# EAGLE design box_opener (EAGLE 9.3.2)
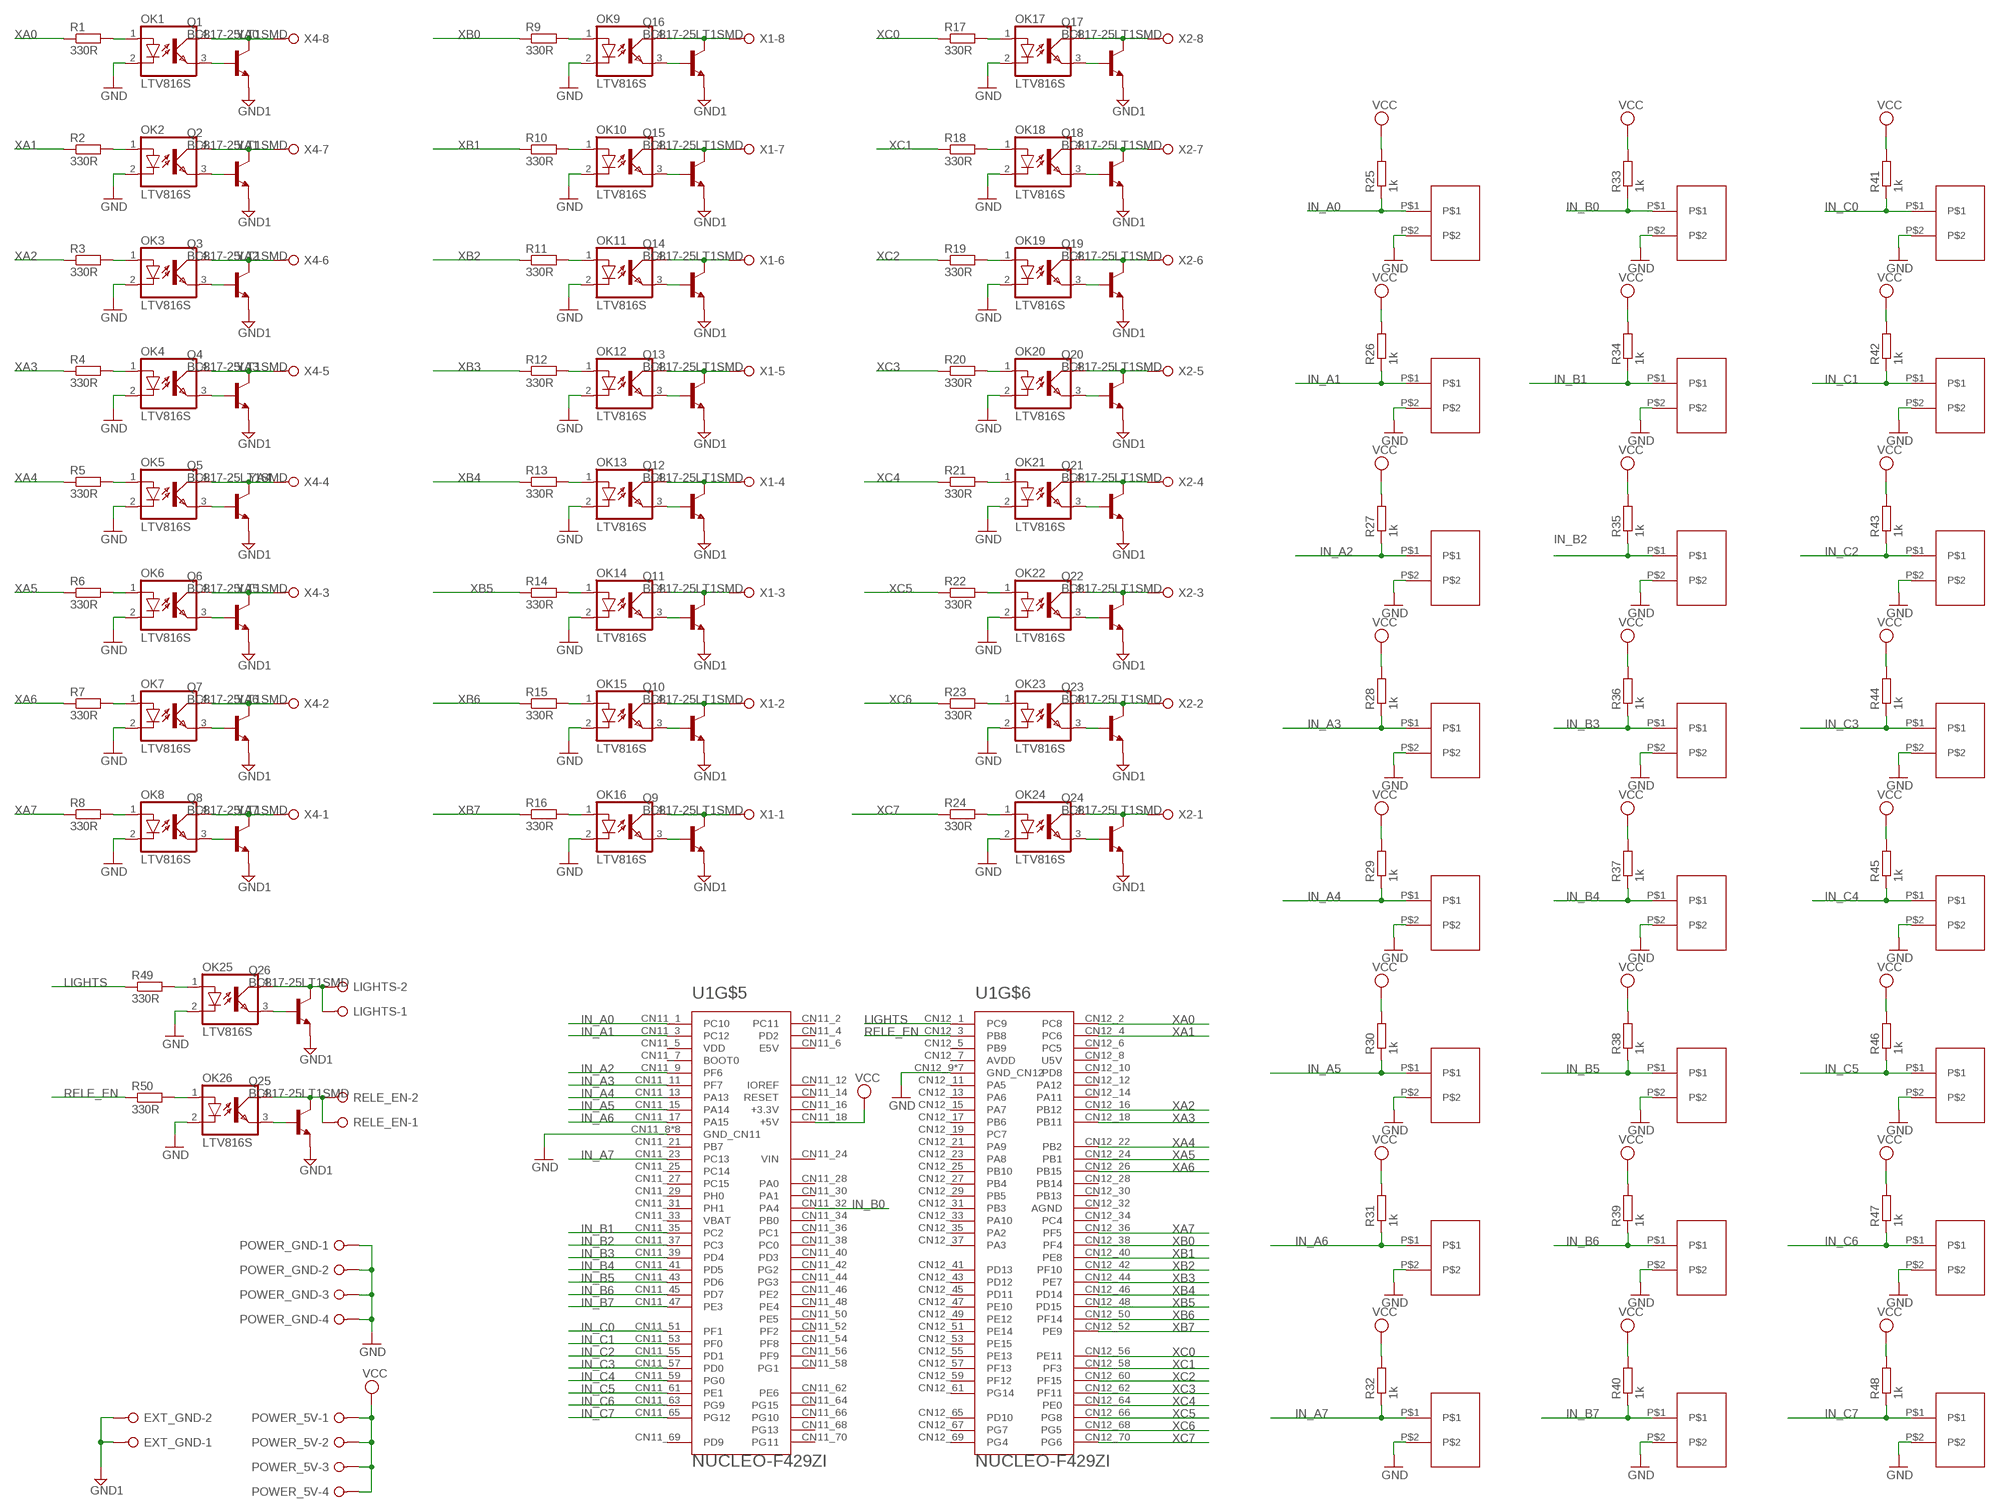
[diagram p0: schematic, sheet 1]

## Parts
EXT_GND  W237-02P  [W237-132]
LIGHTS  W237-02P  [W237-132]
OK1  LTV816S  [DIL4-SMD]
OK2  LTV816S  [DIL4-SMD]
OK3  LTV816S  [DIL4-SMD]
OK4  LTV816S  [DIL4-SMD]
OK5  LTV816S  [DIL4-SMD]
OK6  LTV816S  [DIL4-SMD]
OK7  LTV816S  [DIL4-SMD]
OK8  LTV816S  [DIL4-SMD]
OK9  LTV816S  [DIL4-SMD]
OK10  LTV816S  [DIL4-SMD]
OK11  LTV816S  [DIL4-SMD]
OK12  LTV816S  [DIL4-SMD]
OK13  LTV816S  [DIL4-SMD]
OK14  LTV816S  [DIL4-SMD]
OK15  LTV816S  [DIL4-SMD]
OK16  LTV816S  [DIL4-SMD]
OK17  LTV816S  [DIL4-SMD]
OK18  LTV816S  [DIL4-SMD]
OK19  LTV816S  [DIL4-SMD]
OK20  LTV816S  [DIL4-SMD]
OK21  LTV816S  [DIL4-SMD]
OK22  LTV816S  [DIL4-SMD]
OK23  LTV816S  [DIL4-SMD]
OK24  LTV816S  [DIL4-SMD]
OK25  LTV816S  [DIL4-SMD]
OK26  LTV816S  [DIL4-SMD]
POWER_5V  W237-04P  [W237-4P]
POWER_GND  W237-04P  [W237-4P]
Q1  BC817-25LT1SMD  [SOT23-BEC]
Q2  BC817-25LT1SMD  [SOT23-BEC]
Q3  BC817-25LT1SMD  [SOT23-BEC]
Q4  BC817-25LT1SMD  [SOT23-BEC]
Q5  BC817-25LT1SMD  [SOT23-BEC]
Q6  BC817-25LT1SMD  [SOT23-BEC]
Q7  BC817-25LT1SMD  [SOT23-BEC]
Q8  BC817-25LT1SMD  [SOT23-BEC]
Q9  BC817-25LT1SMD  [SOT23-BEC]
Q10  BC817-25LT1SMD  [SOT23-BEC]
Q11  BC817-25LT1SMD  [SOT23-BEC]
Q12  BC817-25LT1SMD  [SOT23-BEC]
Q13  BC817-25LT1SMD  [SOT23-BEC]
Q14  BC817-25LT1SMD  [SOT23-BEC]
Q15  BC817-25LT1SMD  [SOT23-BEC]
Q16  BC817-25LT1SMD  [SOT23-BEC]
Q17  BC817-25LT1SMD  [SOT23-BEC]
Q18  BC817-25LT1SMD  [SOT23-BEC]
Q19  BC817-25LT1SMD  [SOT23-BEC]
Q20  BC817-25LT1SMD  [SOT23-BEC]
Q21  BC817-25LT1SMD  [SOT23-BEC]
Q22  BC817-25LT1SMD  [SOT23-BEC]
Q23  BC817-25LT1SMD  [SOT23-BEC]
Q24  BC817-25LT1SMD  [SOT23-BEC]
Q25  BC817-25LT1SMD  [SOT23-BEC]
Q26  BC817-25LT1SMD  [SOT23-BEC]
R1  330R  R-EU_M1206  [M1206]
R2  330R  R-EU_M1206  [M1206]
R3  330R  R-EU_M1206  [M1206]
R4  330R  R-EU_M1206  [M1206]
R5  330R  R-EU_M1206  [M1206]
R6  330R  R-EU_M1206  [M1206]
R7  330R  R-EU_M1206  [M1206]
R8  330R  R-EU_M1206  [M1206]
R9  330R  R-EU_M1206  [M1206]
R10  330R  R-EU_M1206  [M1206]
R11  330R  R-EU_M1206  [M1206]
R12  330R  R-EU_M1206  [M1206]
R13  330R  R-EU_M1206  [M1206]
R14  330R  R-EU_M1206  [M1206]
R15  330R  R-EU_M1206  [M1206]
R16  330R  R-EU_M1206  [M1206]
R17  330R  R-EU_M1206  [M1206]
R18  330R  R-EU_M1206  [M1206]
R19  330R  R-EU_M1206  [M1206]
R20  330R  R-EU_M1206  [M1206]
R21  330R  R-EU_M1206  [M1206]
R22  330R  R-EU_M1206  [M1206]
R23  330R  R-EU_M1206  [M1206]
R24  330R  R-EU_M1206  [M1206]
R25  1k  R-EU_M1206  [M1206]
R26  1k  R-EU_M1206  [M1206]
R27  1k  R-EU_M1206  [M1206]
R28  1k  R-EU_M1206  [M1206]
R29  1k  R-EU_M1206  [M1206]
R30  1k  R-EU_M1206  [M1206]
R31  1k  R-EU_M1206  [M1206]
R32  1k  R-EU_M1206  [M1206]
R33  1k  R-EU_M1206  [M1206]
R34  1k  R-EU_M1206  [M1206]
R35  1k  R-EU_M1206  [M1206]
R36  1k  R-EU_M1206  [M1206]
R37  1k  R-EU_M1206  [M1206]
R38  1k  R-EU_M1206  [M1206]
R39  1k  R-EU_M1206  [M1206]
R40  1k  R-EU_M1206  [M1206]
R41  1k  R-EU_M1206  [M1206]
R42  1k  R-EU_M1206  [M1206]
R43  1k  R-EU_M1206  [M1206]
R44  1k  R-EU_M1206  [M1206]
R45  1k  R-EU_M1206  [M1206]
R46  1k  R-EU_M1206  [M1206]
R47  1k  R-EU_M1206  [M1206]
R48  1k  R-EU_M1206  [M1206]
R49  330R  R-EU_M1206  [M1206]
R50  330R  R-EU_M1206  [M1206]
RELE_EN  W237-02P  [W237-132]
U1  NUCLEO-F429ZI  [MODULE_NUCLEO-F429ZI]
U$1  PSH04-02  [PSH04-02]
U$2  PSH04-02  [PSH04-02]
U$3  PSH04-02  [PSH04-02]
U$4  PSH04-02  [PSH04-02]
U$5  PSH04-02  [PSH04-02]
U$6  PSH04-02  [PSH04-02]
U$7  PSH04-02  [PSH04-02]
U$8  PSH04-02  [PSH04-02]
U$9  PSH04-02  [PSH04-02]
U$10  PSH04-02  [PSH04-02]
U$11  PSH04-02  [PSH04-02]
U$12  PSH04-02  [PSH04-02]
U$13  PSH04-02  [PSH04-02]
U$14  PSH04-02  [PSH04-02]
U$15  PSH04-02  [PSH04-02]
U$16  PSH04-02  [PSH04-02]
U$17  PSH04-02  [PSH04-02]
U$18  PSH04-02  [PSH04-02]
U$19  PSH04-02  [PSH04-02]
U$20  PSH04-02  [PSH04-02]
U$21  PSH04-02  [PSH04-02]
U$22  PSH04-02  [PSH04-02]
U$23  PSH04-02  [PSH04-02]
U$24  PSH04-02  [PSH04-02]
X1  W237-08P  [W237-8P]
X2  W237-08P  [W237-8P]
X4  W237-08P  [W237-8P]

## Nets
GND: OK1.2(C) OK2.2(C) OK3.2(C) OK4.2(C) OK5.2(C) OK6.2(C) OK7.2(C) OK8.2(C) OK9.2(C) OK10.2(C) OK11.2(C) OK12.2(C) OK13.2(C) OK14.2(C) OK15.2(C) OK16.2(C) OK17.2(C) OK18.2(C) OK19.2(C) OK20.2(C) OK21.2(C) OK22.2(C) OK23.2(C) OK24.2(C) OK25.2(C) OK26.2(C) POWER_GND.1 POWER_GND.2 POWER_GND.3 POWER_GND.4 U1.CN11_8(GND_CN11) U1.CN11_19(GND_CN11) U1.CN11_20(GND_CN11) U1.CN11_22(GND_CN11) U1.CN11_49(GND_CN11) U1.CN11_60(GND_CN11) U1.CN11_71(GND_CN11) U1.CN11_72(GND_CN11) U1.CN12_9(GND_CN12) U1.CN12_20(GND_CN12) U1.CN12_39(GND_CN12) U1.CN12_54(GND_CN12) U1.CN12_63(GND_CN12) U1.CN12_71(GND_CN12) U1.CN12_72(GND_CN12) U$1.P$2 U$2.P$2 U$3.P$2 U$4.P$2 U$5.P$2 U$6.P$2 U$7.P$2 U$8.P$2 U$9.P$2 U$10.P$2 U$11.P$2 U$12.P$2 U$13.P$2 U$14.P$2 U$15.P$2 U$16.P$2 U$17.P$2 U$18.P$2 U$19.P$2 U$20.P$2 U$21.P$2 U$22.P$2 U$23.P$2 U$24.P$2
GND1: EXT_GND.1 EXT_GND.2 Q1.E Q2.E Q3.E Q4.E Q5.E Q6.E Q7.E Q8.E Q9.E Q10.E Q11.E Q12.E Q13.E Q14.E Q15.E Q16.E Q17.E Q18.E Q19.E Q20.E Q21.E Q22.E Q23.E Q24.E Q25.E Q26.E
IN_A0: R25.1 U1.CN11_1(PC10) U$1.P$1
IN_A1: R26.1 U1.CN11_3(PC12) U$2.P$1
IN_A2: R27.1 U1.CN11_9(PF6) U$3.P$1
IN_A3: R28.1 U1.CN11_11(PF7) U$4.P$1
IN_A4: R29.1 U1.CN11_13(PA13) U$5.P$1
IN_A5: R30.1 U1.CN11_15(PA14) U$6.P$1
IN_A6: R31.1 U1.CN11_17(PA15) U$7.P$1
IN_A7: R32.1 U1.CN11_23(PC13) U$8.P$1
IN_B0: R33.1 U1.CN11_32(PA4) U$9.P$1
IN_B1: R34.1 U1.CN11_35(PC2) U$10.P$1
IN_B2: R35.1 U1.CN11_37(PC3) U$11.P$1
IN_B3: R36.1 U1.CN11_39(PD4) U$12.P$1
IN_B4: R37.1 U1.CN11_41(PD5) U$13.P$1
IN_B5: R38.1 U1.CN11_43(PD6) U$14.P$1
IN_B6: R39.1 U1.CN11_45(PD7) U$15.P$1
IN_B7: R40.1 U1.CN11_47(PE3) U$16.P$1
IN_C0: R41.1 U1.CN11_51(PF1) U$17.P$1
IN_C1: R42.1 U1.CN11_53(PF0) U$18.P$1
IN_C2: R43.1 U1.CN11_55(PD1) U$19.P$1
IN_C3: R44.1 U1.CN11_57(PD0) U$20.P$1
IN_C4: R45.1 U1.CN11_59(PG0) U$21.P$1
IN_C5: R46.1 U1.CN11_61(PE1) U$22.P$1
IN_C6: R47.1 U1.CN11_63(PG9) U$23.P$1
IN_C7: R48.1 U1.CN11_65(PG12) U$24.P$1
LIGHTS: R49.1 U1.CN12_1(PC9)
N$1: OK1.1(A) R1.2
N$2: OK9.1(A) R9.2
N$3: OK2.1(A) R2.2
N$4: OK10.1(A) R10.2
N$5: OK11.1(A) R11.2
N$6: OK12.1(A) R12.2
N$7: OK3.1(A) R3.2
N$8: OK13.1(A) R13.2
N$9: OK14.1(A) R14.2
N$10: OK4.1(A) R4.2
N$11: OK15.1(A) R15.2
N$12: OK16.1(A) R16.2
N$13: OK5.1(A) R5.2
N$14: OK17.1(A) R17.2
N$15: OK18.1(A) R18.2
N$16: OK6.1(A) R6.2
N$17: OK19.1(A) R19.2
N$18: OK20.1(A) R20.2
N$19: OK7.1(A) R7.2
N$20: OK21.1(A) R21.2
N$21: OK22.1(A) R22.2
N$22: OK8.1(A) R8.2
N$23: OK23.1(A) R23.2
N$24: OK24.1(A) R24.2
N$25: OK25.1(A) R49.2
N$26: OK26.1(A) R50.2
N$27: OK26.4(COL) Q25.C RELE_EN.1 RELE_EN.2
N$28: LIGHTS.1 LIGHTS.2 OK25.4(COL) Q26.C
N$29: OK2.3(EMIT) Q2.B
N$30: OK1.3(EMIT) Q1.B
N$31: OK3.3(EMIT) Q3.B
N$32: OK4.3(EMIT) Q4.B
N$33: OK16.4(COL) Q9.C X1.1
N$34: OK15.4(COL) Q10.C X1.2
N$35: OK14.4(COL) Q11.C X1.3
N$36: OK13.4(COL) Q12.C X1.4
N$37: OK12.4(COL) Q13.C X1.5
N$38: OK11.4(COL) Q14.C X1.6
N$39: OK10.4(COL) Q15.C X1.7
N$40: OK9.4(COL) Q16.C X1.8
N$41: OK17.4(COL) Q17.C X2.8
N$42: OK18.4(COL) Q18.C X2.7
N$43: OK19.4(COL) Q19.C X2.6
N$44: OK20.4(COL) Q20.C X2.5
N$45: OK21.4(COL) Q21.C X2.4
N$46: OK22.4(COL) Q22.C X2.3
N$47: OK23.4(COL) Q23.C X2.2
N$48: OK24.4(COL) Q24.C X2.1
N$49: OK5.3(EMIT) Q5.B
N$50: OK6.3(EMIT) Q6.B
N$51: OK7.3(EMIT) Q7.B
N$52: OK8.3(EMIT) Q8.B
N$53: OK16.3(EMIT) Q9.B
N$54: OK15.3(EMIT) Q10.B
N$55: OK13.3(EMIT) Q12.B
N$56: OK14.3(EMIT) Q11.B
N$57: OK12.3(EMIT) Q13.B
N$58: OK11.3(EMIT) Q14.B
N$59: OK10.3(EMIT) Q15.B
N$60: OK9.3(EMIT) Q16.B
N$61: OK17.3(EMIT) Q17.B
N$62: OK18.3(EMIT) Q18.B
N$63: OK19.3(EMIT) Q19.B
N$64: OK20.3(EMIT) Q20.B
N$65: OK21.3(EMIT) Q21.B
N$66: OK22.3(EMIT) Q22.B
N$67: OK23.3(EMIT) Q23.B
N$68: OK24.3(EMIT) Q24.B
N$69: OK26.3(EMIT) Q25.B
N$70: OK25.3(EMIT) Q26.B
RELE_EN: R50.1 U1.CN12_3(PB8)
VCC: POWER_5V.1 POWER_5V.2 POWER_5V.3 POWER_5V.4 R25.2 R26.2 R27.2 R28.2 R29.2 R30.2 R31.2 R32.2 R33.2 R34.2 R35.2 R36.2 R37.2 R38.2 R39.2 R40.2 R41.2 R42.2 R43.2 R44.2 R45.2 R46.2 R47.2 R48.2 U1.CN11_18(+5V)
XA0: R1.1 U1.CN12_2(PC8)
XA1: R2.1 U1.CN12_4(PC6)
XA2: R3.1 U1.CN12_16(PB12)
XA3: R4.1 U1.CN12_18(PB11)
XA4: R5.1 U1.CN12_22(PB2)
XA5: R6.1 U1.CN12_24(PB1)
XA6: R7.1 U1.CN12_26(PB15)
XA7: R8.1 U1.CN12_36(PF5)
XB0: R9.1 U1.CN12_38(PF4)
XB1: R10.1 U1.CN12_40(PE8)
XB2: R11.1 U1.CN12_42(PF10)
XB3: R12.1 U1.CN12_44(PE7)
XB4: R13.1 U1.CN12_46(PD14)
XB5: R14.1 U1.CN12_48(PD15)
XB6: R15.1 U1.CN12_50(PF14)
XB7: R16.1 U1.CN12_52(PE9)
XC0: R17.1 U1.CN12_56(PE11)
XC1: R18.1 U1.CN12_58(PF3)
XC2: R19.1 U1.CN12_60(PF15)
XC3: R20.1 U1.CN12_62(PF11)
XC4: R21.1 U1.CN12_64(PE0)
XC5: R22.1 U1.CN12_66(PG8)
XC6: R23.1 U1.CN12_68(PG5)
XC7: R24.1 U1.CN12_70(PG6)
YA0: OK1.4(COL) Q1.C X4.8
YA1: OK2.4(COL) Q2.C X4.7
YA2: OK3.4(COL) Q3.C X4.6
YA3: OK4.4(COL) Q4.C X4.5
YA4: OK5.4(COL) Q5.C X4.4
YA5: OK6.4(COL) Q6.C X4.3
YA6: OK7.4(COL) Q7.C X4.2
YA7: OK8.4(COL) Q8.C X4.1
Unconnected: U1.CN7_1(D16/PC6/I2S_A_MCK) U1.CN7_2(D15/PB8/I2C_A_SCL) U1.CN7_3(D17/PB15/I2S_A_SD) U1.CN7_4(D14/PB9/I2C_A_SDA) U1.CN7_5(D18/PB13/I2S_A_CK) U1.CN7_6(AVDD) U1.CN7_7(D19/PB12/I2S_A_WS) U1.CN7_8(GND_CN7) U1.CN7_9(D20/PA15/I2S_B_WS) U1.CN7_10(D13/PA5/SPI_A_SCK) U1.CN7_11(D21/PC7/I2S_B_MCK) U1.CN7_12(D12/PA6/SPI_A_MISO) U1.CN7_13(D22/PB5/I2S_B_SD/SPI_B_MOSI) U1.CN7_14(D11/ETH/PA7/SPI_A_MOSI/TIM_E_PWM1) U1.CN7_15(D23/PB3/I2S_B_CK/SPI_B_SCK) U1.CN7_16(D10/PD14/SPI_A_CS/TIM_B_PWM3) U1.CN7_17(D24/PA4/SPI_B_NSS) U1.CN7_18(D9/PD15/TIMER_B_PWM2) U1.CN7_19(D25/PB4/SPI_B_MISO) U1.CN7_20(D8/PF12) U1.CN8_2(D43/PC8/SDMMC_D0) U1.CN8_3(IOREF) U1.CN8_4(D44/PC9/SDMMC_D1/I2S_A_CKIN) U1.CN8_5(RESET) U1.CN8_6(D45/PC10/SDMMC_D2) U1.CN8_7(+3.3V) U1.CN8_8(D46/PC11/SDMMC_D3) U1.CN8_9(+5V) U1.CN8_10(D47/PC12/SDMMC_CK) U1.CN8_11(GND_CN8) U1.CN8_12(D48/PD2/SDMMC_CMD) U1.CN8_13(GND_CN8) U1.CN8_14(D49/PG2) U1.CN8_15(VIN) U1.CN8_16(D50/PG3) U1.CN9_1(A0/PA3) U1.CN9_2(D51/PD7/USART_B_SCLK) U1.CN9_3(A1/PC0) U1.CN9_4(D52/PD6/USART_B_RX) U1.CN9_5(A2/PC3) U1.CN9_6(D53/PD5/USART_B_TX) U1.CN9_7(A3/PF3) U1.CN9_8(D54/PD4/USART_B_RTS) U1.CN9_9(A4/PF5) U1.CN9_10(D55/PD3/USART_B_CTS) U1.CN9_11(A5/PF10) U1.CN9_12(GND_CN9) U1.CN9_13(D72/NC) U1.CN9_14(D56/PE2/SAI_A_MCLK) U1.CN9_15(D71/PA7) U1.CN9_16(D57/PE4/SAI_A_FS) U1.CN9_17(D70/PF2/I2C_B_SMBA) U1.CN9_18(D58/PE5/SAI_A_SCK) U1.CN9_19(D69/PF1/I2C_B_SCL) U1.CN9_20(D59/PE6/SAI_A_SD) U1.CN9_21(D68/PF0/I2C_B_SDA) U1.CN9_22(D60/PE3/SAI_B_SD) U1.CN9_23(GND_CN9) U1.CN9_24(D61/PF8/SAI_B_SCK) U1.CN9_25(D67/PD0/CAN_RX) U1.CN9_26(D62/PF7/SAI_B_MCLK) U1.CN9_27(D66/PD1/CAN_TX) U1.CN9_28(D63/PF9/SAI_B_FS) U1.CN9_29(D65/PG0) U1.CN9_30(D64/PG1) U1.CN10_1(AVDD) U1.CN10_2(D7/PF13) U1.CN10_3(AGND) U1.CN10_4(D6/PE9/TIMER_A_PWM1) U1.CN10_5(GND_CN10) U1.CN10_6(D5/PE11/TIMER_A_PWM2) U1.CN10_7(A6/PB1/ADC_A_IN) U1.CN10_8(D4/PF14) U1.CN10_9(A7/PC2/ADC_B_IN) U1.CN10_10(D3/PE13/TIMER_A_PWM3) U1.CN10_11(A8/PF4/ADC_C_IN) U1.CN10_12(D2/PF15) U1.CN10_13(D26/PB6) U1.CN10_14(D1/PG14/USART_A_TX) U1.CN10_15(D27/PB2) U1.CN10_16(D0/PG9/USART_A_RX) U1.CN10_17(GND_CN10) U1.CN10_18(D42/PE8/TIMER_A_PWM1N) U1.CN10_19(D28/PD13) U1.CN10_20(D41/PE7/TIMER_A_ETR) U1.CN10_21(D29/PD12) U1.CN10_22(GND_CN10) U1.CN10_23(D30/PD11) U1.CN10_24(D40/PE10/TIMER_A_PWM2N) U1.CN10_25(D31/PE2) U1.CN10_26(D39/PE12/TIMER_A_PWM3N) U1.CN10_27(GND_CN10) U1.CN10_28(D38/PE14) U1.CN10_29(D32/PA0/TIMER_C_PWM1) U1.CN10_30(D37/PE15/TIMER_A_BKIN1) U1.CN10_31(D33/PB0/TIMER_D_PWM1) U1.CN10_32(D36/PB10/TIMER_C_PWM2) U1.CN10_33(D34/PE0/TIMER_B_ETR) U1.CN10_34(D35/PB11/TIMER_C_PWM3) U1.CN11_2(PC11) U1.CN11_4(PD2) U1.CN11_5(VDD) U1.CN11_6(E5V) U1.CN11_7(BOOT0) U1.CN11_12(IOREF) U1.CN11_14(RESET) U1.CN11_16(+3.3V) U1.CN11_21(PB7) U1.CN11_24(VIN) U1.CN11_25(PC14) U1.CN11_27(PC15) U1.CN11_28(PA0) U1.CN11_29(PH0) U1.CN11_30(PA1) U1.CN11_31(PH1) U1.CN11_33(VBAT) U1.CN11_34(PB0) U1.CN11_36(PC1) U1.CN11_38(PC0) U1.CN11_40(PD3) U1.CN11_42(PG2) U1.CN11_44(PG3) U1.CN11_46(PE2) U1.CN11_48(PE4) U1.CN11_50(PE5) U1.CN11_52(PF2) U1.CN11_54(PF8) U1.CN11_56(PF9) U1.CN11_58(PG1) U1.CN11_62(PE6) U1.CN11_64(PG15) U1.CN11_66(PG10) U1.CN11_68(PG13) U1.CN11_69(PD9) U1.CN11_70(PG11) U1.CN12_5(PB9) U1.CN12_6(PC5) U1.CN12_7(AVDD) U1.CN12_8(U5V) U1.CN12_10(PD8) U1.CN12_11(PA5) U1.CN12_12(PA12) U1.CN12_13(PA6) U1.CN12_14(PA11) U1.CN12_15(PA7) U1.CN12_17(PB6) U1.CN12_19(PC7) U1.CN12_21(PA9) U1.CN12_23(PA8) U1.CN12_25(PB10) U1.CN12_27(PB4) U1.CN12_28(PB14) U1.CN12_29(PB5) U1.CN12_30(PB13) U1.CN12_31(PB3) U1.CN12_32(AGND) U1.CN12_33(PA10) U1.CN12_34(PC4) U1.CN12_35(PA2) U1.CN12_37(PA3) U1.CN12_41(PD13) U1.CN12_43(PD12) U1.CN12_45(PD11) U1.CN12_47(PE10) U1.CN12_49(PE12) U1.CN12_51(PE14) U1.CN12_53(PE15) U1.CN12_55(PE13) U1.CN12_57(PF13) U1.CN12_59(PF12) U1.CN12_61(PG14) U1.CN12_65(PD10) U1.CN12_67(PG7) U1.CN12_69(PG4)

## Library data of the parts
EXT_GND LIGHTS RELE_EN = con-wago-508:W237-02P: WAGO SREW CLAMP; OC_FARNELL: unknown; OC_NEWARK: unknown
OK1-OK26 = optocoupler:LTV816: OPTO COUPLER Source: LITEON, LTV816.pdf
POWER_5V POWER_GND = con-wago-508:W237-04P: WAGO SREW CLAMP; OC_FARNELL: unknown; OC_NEWARK: unknown
Q1-Q26 = transistor-npn:BC817*: NPN Transistor
R1-R50 = rcl:R-EU_: RESISTOR, European symbol; SPICEPREFIX: R
U1 = NUCLEO-F429ZI:NUCLEO-F429ZI: STM32 Nucleo-144 development board with STM32F429ZIT6 MCU, supports Arduino, ST Zio and Morpho; DESCRIPTION: STM32 Nucleo-144 development board with STM32F429ZIT6 MCU, supports Arduino, ST Zio and Morpho; DIGI-KEY_PART_NUMBER: 497-16280-ND; DIGI-KEY_PURCHASE_URL: https://www.digikey.com/product-detail/en/stmicroelectronics/NUCLEO-F429ZI/497-16280-ND/5806777?utm_source=snapeda&utm_medium=aggregator&utm_campaign=symbol; MF: STMicroelectronics; MP: NUCLEO-F429ZI; PACKAGE: None
U$1-U$24 = PSH_conector:PSH04-02
X1 X2 X4 = con-wago-508:W237-08P: WAGO SREW CLAMP; OC_FARNELL: unknown; OC_NEWARK: unknown

## Board
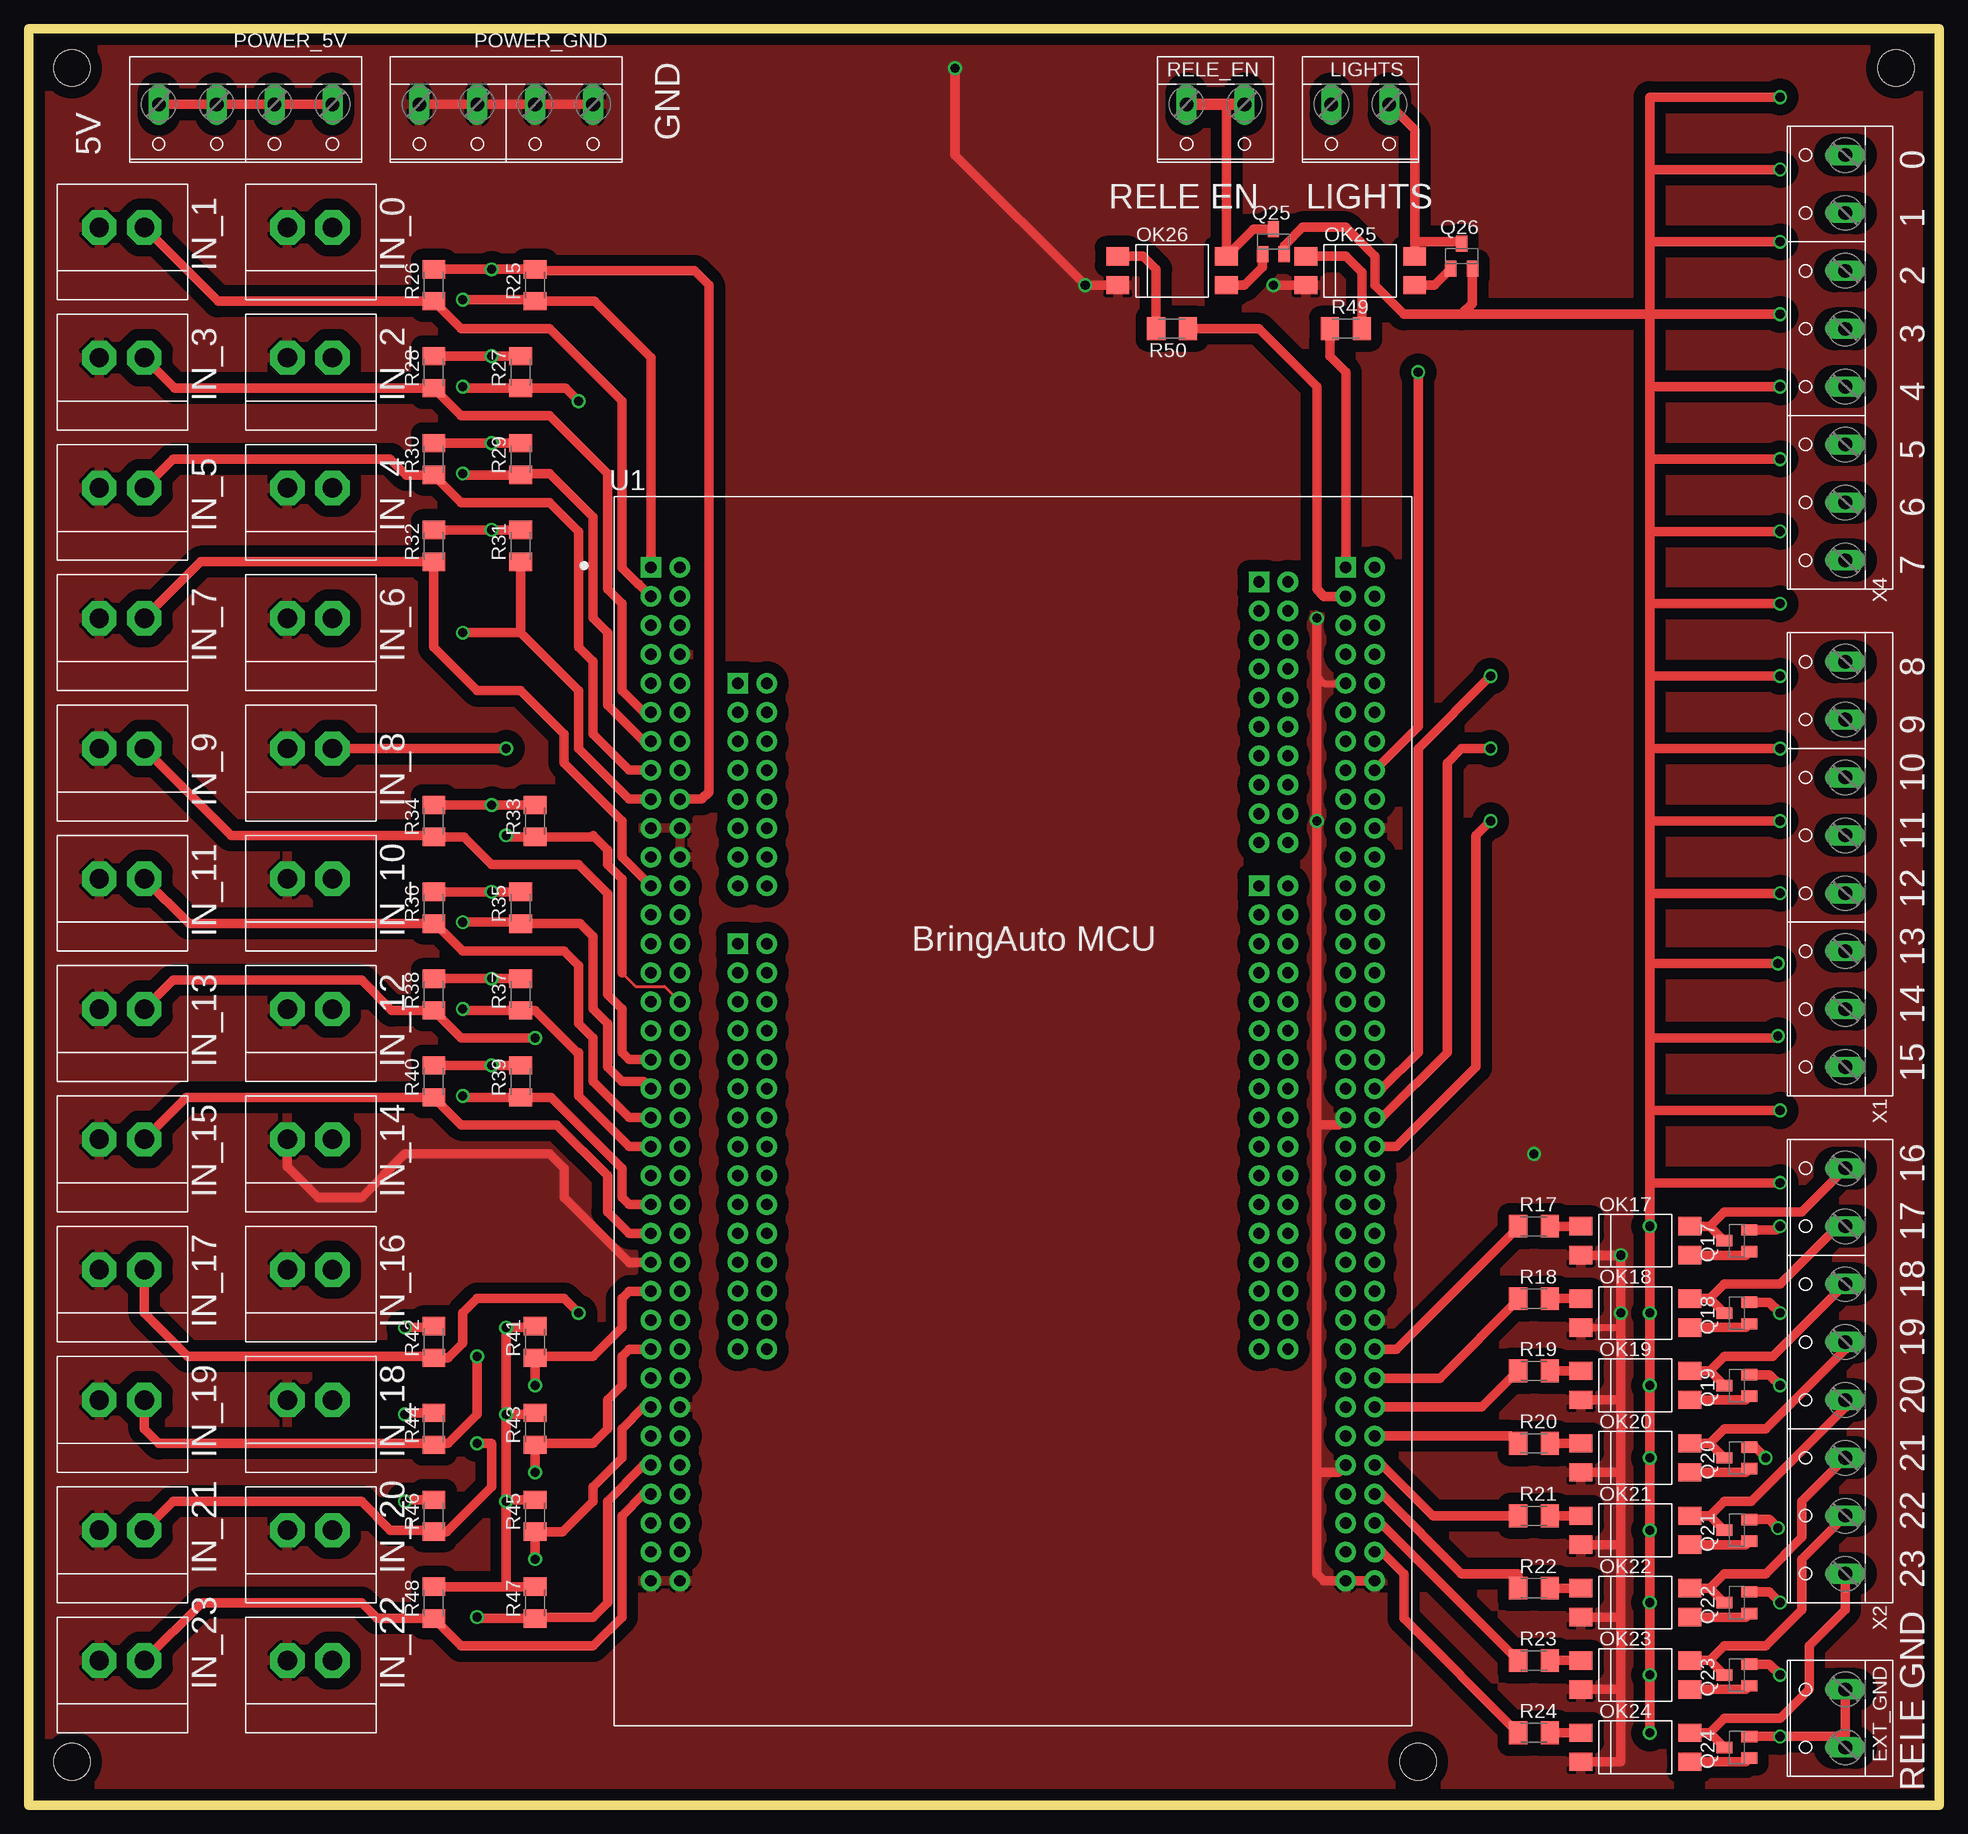
[diagram p1: board, top side]
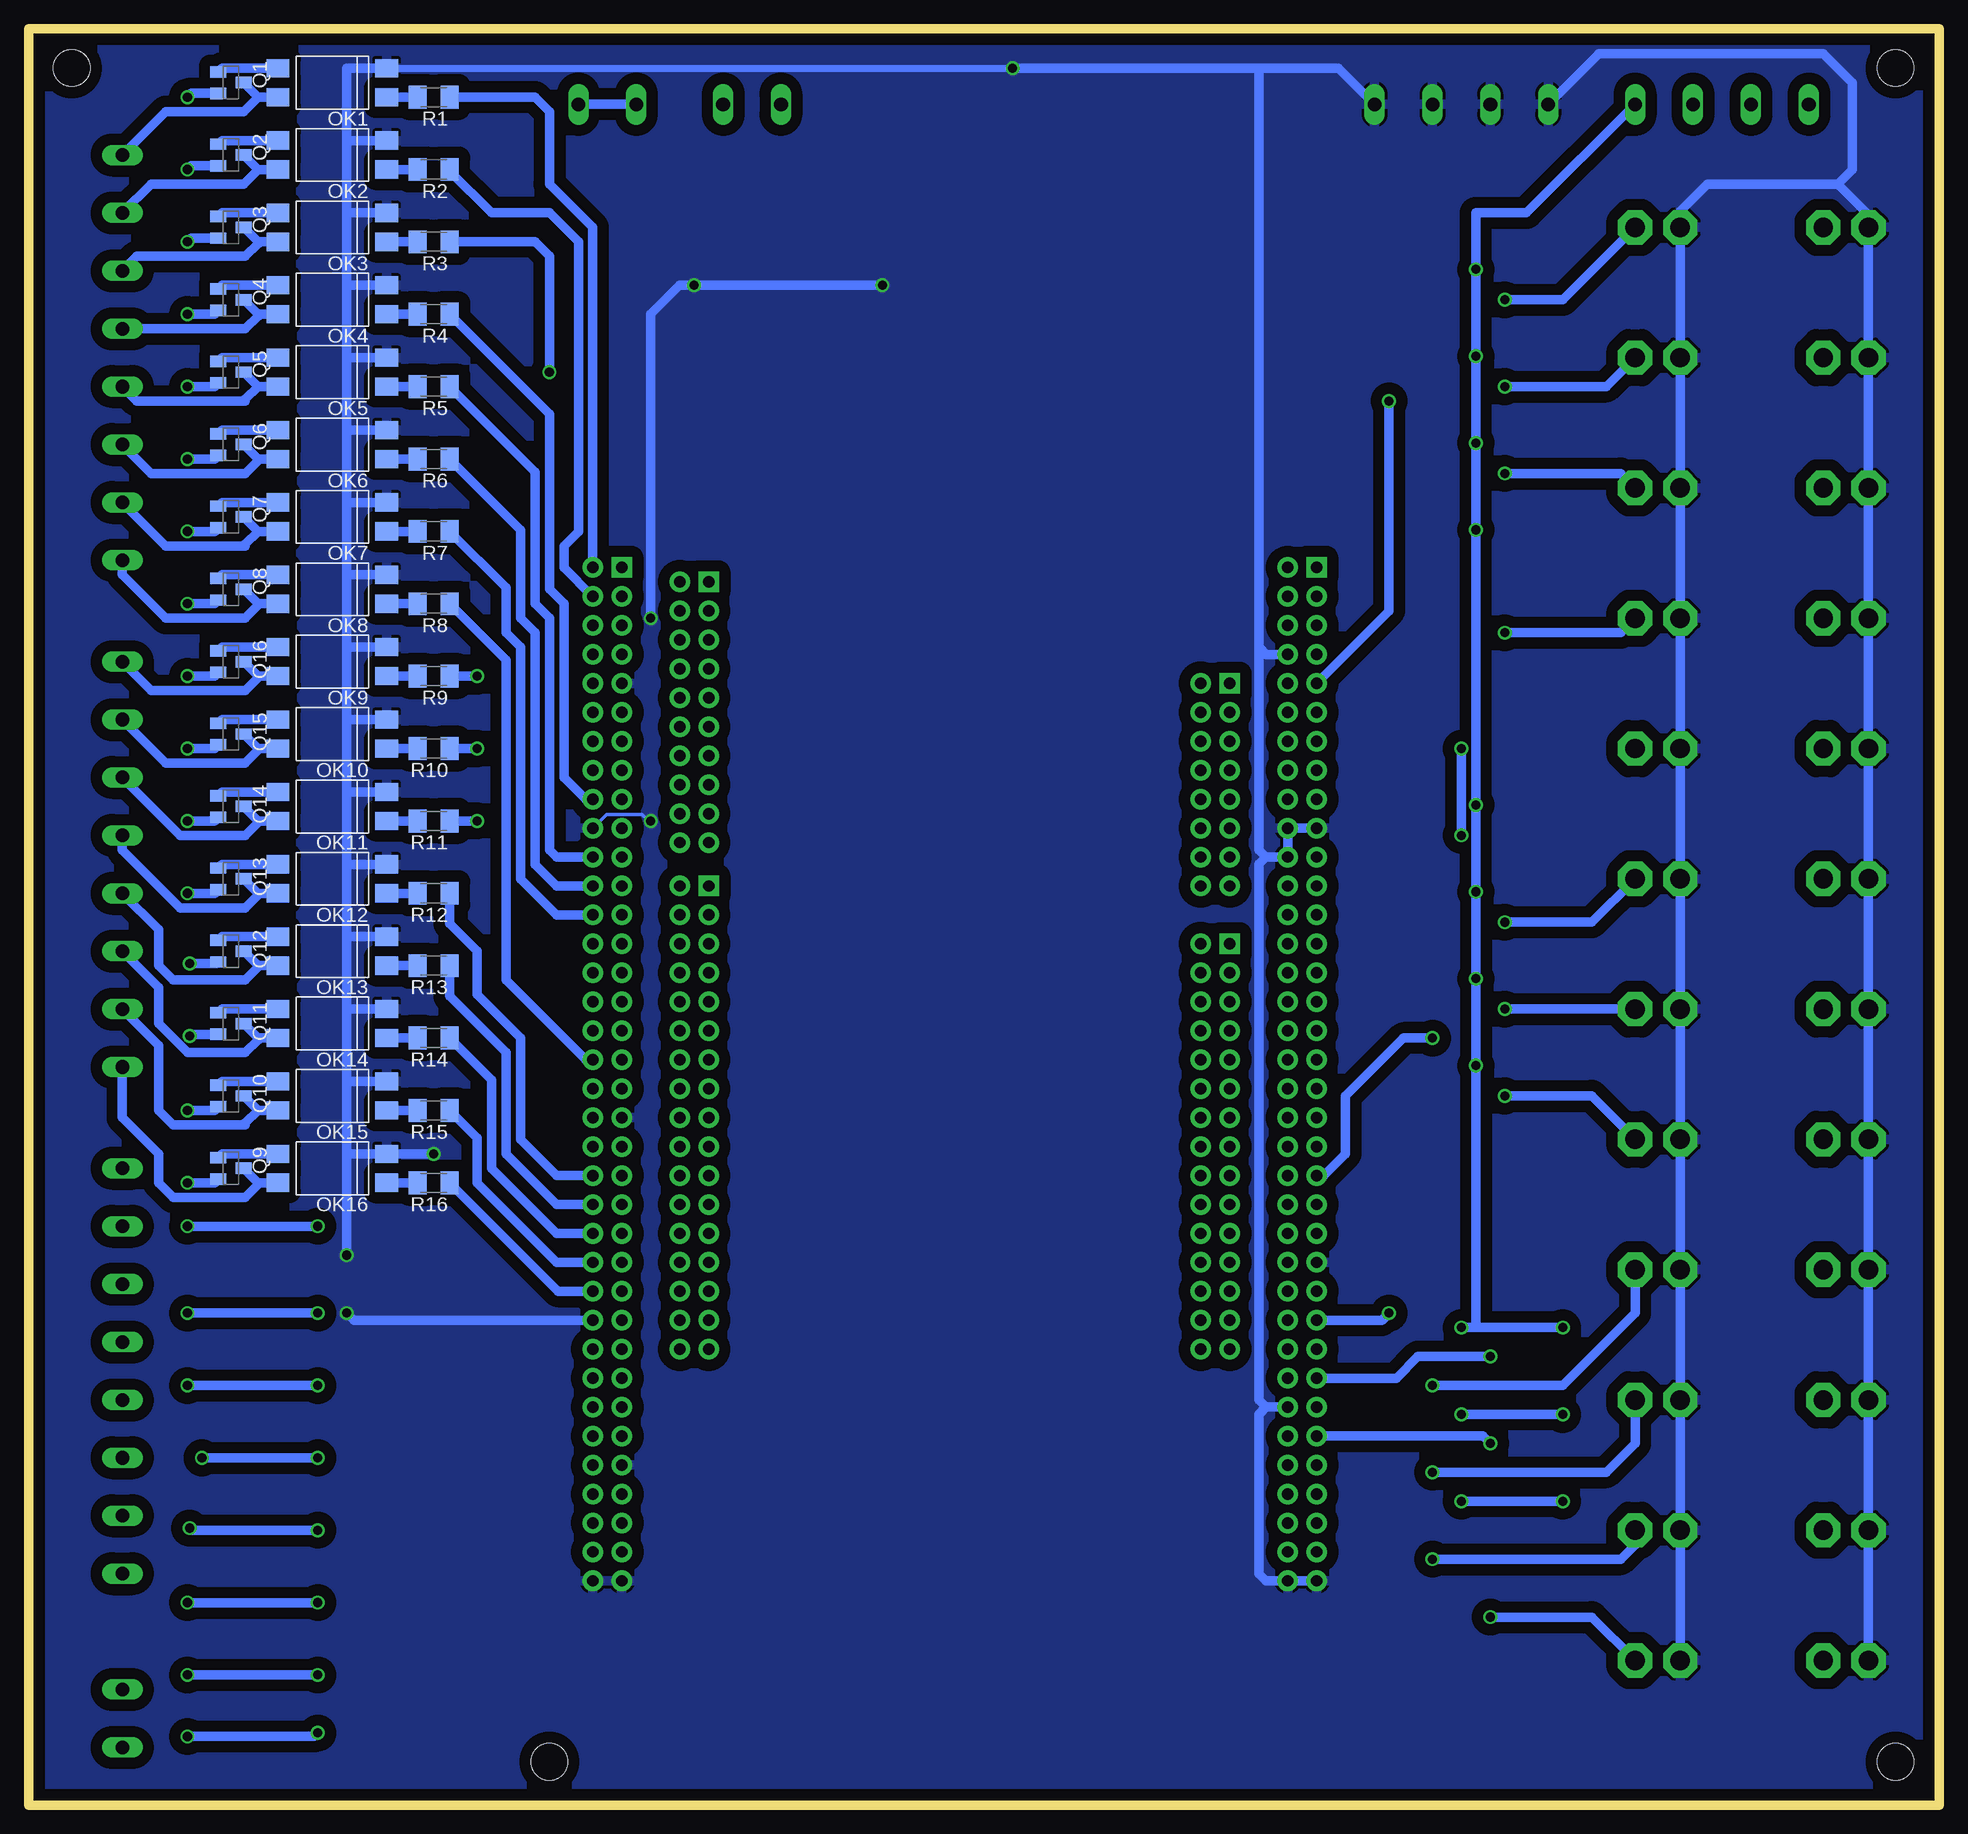
[diagram p2: board, bottom side, seen from below]

Size 167.62 x 155.88 mm. Coordinates in mm from the lower left corner, seen from the top.
Outline: 0,0 167.62,0 167.62,155.88 0,155.88 0,0
Copper layers (1*16): Top 0.035mm / dielectric 1.5mm / Bottom 0.035mm
Design rules "default": minimum track width 6mil, minimum drill 0.35mm, track to track 6mil, track to pad 6mil, pad to pad 6mil, via to via 6mil, smd to smd 6mil, copper to edge 40mil, drill to drill 6mil, minimum pad ring 10mil, minimum via ring 8mil, stop-mask expansion 4mil, vias tented up to drill 0mil, thermal gap 10mil
Holes 3.2 mm at 3.81,3.81 121.92,3.81 163.83,152.4 3.81,152.4

### Footprints (pad centres in the part's own frame; a part is rotated, then mirrored left to right if it is on the bottom)
W237-132 = drill 1.194 long: 1 -2.54,-0.635; 2 2.54,-0.635
DIL4-SMD = smd 1.6 x 2: 1 -1.27,-4.77; 2 1.27,-4.77; 3 1.27,4.77; 4 -1.27,4.77
W237-4P = drill 1.194 long: 1 -7.62,-0.635; 2 -2.54,-0.635; 3 2.54,-0.635; 4 7.62,-0.635
SOT23-BEC = smd 1 x 1.4: B -0.95,-1.1; C 0,1.1; E 0.95,-1.1
M1206 = smd 1.6 x 2: 1 -1.4,0; 2 1.4,0
MODULE_NUCLEO-F429ZI = drill 1 pad 1.8 square: CN7_1 21.59,43.82; CN8_1 -24.13,34.93; CN9_1 -24.13,12.07; CN10_1 21.59,17.15; CN11_1 -31.75,45.09; CN12_1 29.21,45.09 | drill 1 pad 1.8: CN7_2 24.13,43.82; CN7_3 21.59,41.28; CN7_4 24.13,41.28; CN7_5 21.59,38.74; CN7_6 24.13,38.74; CN7_7 21.59,36.2; CN7_8 24.13,36.2; CN7_9 21.59,33.66; CN7_10 24.13,33.66; CN7_11 21.59,31.12; CN7_12 24.13,31.12; CN7_13 21.59,28.58; CN7_14 24.13,28.58; CN7_15 21.59,26.04; CN7_16 24.13,26.04; CN7_17 21.59,23.5; CN7_18 24.13,23.5; CN7_19 21.59,20.96; CN7_20 24.13,20.96; CN8_2 -21.59,34.93; CN8_3 -24.13,32.39; CN8_4 -21.59,32.39; CN8_5 -24.13,29.85; CN8_6 -21.59,29.85; CN8_7 -24.13,27.31; CN8_8 -21.59,27.31; CN8_9 -24.13,24.77; CN8_10 -21.59,24.77; CN8_11 -24.13,22.23; CN8_12 -21.59,22.23; CN8_13 -24.13,19.69; CN8_14 -21.59,19.69; CN8_15 -24.13,17.15; CN8_16 -21.59,17.15; CN9_2 -21.59,12.07; CN9_3 -24.13,9.53; CN9_4 -21.59,9.53; CN9_5 -24.13,6.99; CN9_6 -21.59,6.99; CN9_7 -24.13,4.45; CN9_8 -21.59,4.45; CN9_9 -24.13,1.91; CN9_10 -21.59,1.91; CN9_11 -24.13,-0.63; CN9_12 -21.59,-0.63; CN9_13 -24.13,-3.17; CN9_14 -21.59,-3.17; CN9_15 -24.13,-5.71; CN9_16 -21.59,-5.71; CN9_17 -24.13,-8.25; CN9_18 -21.59,-8.25; CN9_19 -24.13,-10.79; CN9_20 -21.59,-10.79; CN9_21 -24.13,-13.33; CN9_22 -21.59,-13.33; CN9_23 -24.13,-15.87; CN9_24 -21.59,-15.87; CN9_25 -24.13,-18.41; CN9_26 -21.59,-18.41; CN9_27 -24.13,-20.95; CN9_28 -21.59,-20.95; CN9_29 -24.13,-23.49; CN9_30 -21.59,-23.49; CN10_2 24.13,17.15; CN10_3 21.59,14.61; CN10_4 24.13,14.61; CN10_5 21.59,12.07; CN10_6 24.13,12.07; CN10_7 21.59,9.53; CN10_8 24.13,9.53; CN10_9 21.59,6.99; CN10_10 24.13,6.99; CN10_11 21.59,4.45; CN10_12 24.13,4.45; CN10_13 21.59,1.91; CN10_14 24.13,1.91; CN10_15 21.59,-0.63; CN10_16 24.13,-0.63; CN10_17 21.59,-3.17; CN10_18 24.13,-3.17; CN10_19 21.59,-5.71; CN10_20 24.13,-5.71; CN10_21 21.59,-8.25; CN10_22 24.13,-8.25; CN10_23 21.59,-10.79; CN10_24 24.13,-10.79; CN10_25 21.59,-13.33; CN10_26 24.13,-13.33; CN10_27 21.59,-15.87; CN10_28 24.13,-15.87; CN10_29 21.59,-18.41; CN10_30 24.13,-18.41; CN10_31 21.59,-20.95; CN10_32 24.13,-20.95; CN10_33 21.59,-23.49; CN10_34 24.13,-23.49; CN11_2 -29.21,45.09; CN11_3 -31.75,42.55; CN11_4 -29.21,42.55; CN11_5 -31.75,40.01; CN11_6 -29.21,40.01; CN11_7 -31.75,37.47; CN11_8 -29.21,37.47; CN11_9 -31.75,34.93; CN11_10 -29.21,34.93; CN11_11 -31.75,32.39; CN11_12 -29.21,32.39; CN11_13 -31.75,29.85; CN11_14 -29.21,29.85; CN11_15 -31.75,27.31; CN11_16 -29.21,27.31; CN11_17 -31.75,24.77; CN11_18 -29.21,24.77; CN11_19 -31.75,22.23; CN11_20 -29.21,22.23; CN11_21 -31.75,19.69; CN11_22 -29.21,19.69; CN11_23 -31.75,17.15; CN11_24 -29.21,17.15; CN11_25 -31.75,14.61; CN11_26 -29.21,14.61; CN11_27 -31.75,12.07; CN11_28 -29.21,12.07; CN11_29 -31.75,9.53; CN11_30 -29.21,9.53; CN11_31 -31.75,6.99; CN11_32 -29.21,6.99; CN11_33 -31.75,4.45; CN11_34 -29.21,4.45; CN11_35 -31.75,1.91; CN11_36 -29.21,1.91; CN11_37 -31.75,-0.63; CN11_38 -29.21,-0.63; CN11_39 -31.75,-3.17; CN11_40 -29.21,-3.17; CN11_41 -31.75,-5.71; CN11_42 -29.21,-5.71; CN11_43 -31.75,-8.25; CN11_44 -29.21,-8.25; CN11_45 -31.75,-10.79; CN11_46 -29.21,-10.79; CN11_47 -31.75,-13.33; CN11_48 -29.21,-13.33; CN11_49 -31.75,-15.87; CN11_50 -29.21,-15.87; CN11_51 -31.75,-18.41; CN11_52 -29.21,-18.41; CN11_53 -31.75,-20.95; CN11_54 -29.21,-20.95; CN11_55 -31.75,-23.49; CN11_56 -29.21,-23.49; CN11_57 -31.75,-26.03; CN11_58 -29.21,-26.03; CN11_59 -31.75,-28.57; CN11_60 -29.21,-28.57; CN11_61 -31.75,-31.11; CN11_62 -29.21,-31.11; CN11_63 -31.75,-33.65; CN11_64 -29.21,-33.65; CN11_65 -31.75,-36.19; CN11_66 -29.21,-36.19; CN11_67 -31.75,-38.73; CN11_68 -29.21,-38.73; CN11_69 -31.75,-41.27; CN11_70 -29.21,-41.27; CN11_71 -31.75,-43.81; CN11_72 -29.21,-43.81; CN12_2 31.75,45.09; CN12_3 29.21,42.55; CN12_4 31.75,42.55; CN12_5 29.21,40.01; CN12_6 31.75,40.01; CN12_7 29.21,37.47; CN12_8 31.75,37.47; CN12_9 29.21,34.93; CN12_10 31.75,34.93; CN12_11 29.21,32.39; CN12_12 31.75,32.39; CN12_13 29.21,29.85; CN12_14 31.75,29.85; CN12_15 29.21,27.31; CN12_16 31.75,27.31; CN12_17 29.21,24.77; CN12_18 31.75,24.77; CN12_19 29.21,22.23; CN12_20 31.75,22.23; CN12_21 29.21,19.69; CN12_22 31.75,19.69; CN12_23 29.21,17.15; CN12_24 31.75,17.15; CN12_25 29.21,14.61; CN12_26 31.75,14.61; CN12_27 29.21,12.07; CN12_28 31.75,12.07; CN12_29 29.21,9.53; CN12_30 31.75,9.53; CN12_31 29.21,6.99; CN12_32 31.75,6.99; CN12_33 29.21,4.45; CN12_34 31.75,4.45; CN12_35 29.21,1.91; CN12_36 31.75,1.91; CN12_37 29.21,-0.63; CN12_38 31.75,-0.63; CN12_39 29.21,-3.17; CN12_40 31.75,-3.17; CN12_41 29.21,-5.71; CN12_42 31.75,-5.71; CN12_43 29.21,-8.25; CN12_44 31.75,-8.25; CN12_45 29.21,-10.79; CN12_46 31.75,-10.79; CN12_47 29.21,-13.33; CN12_48 31.75,-13.33; CN12_49 29.21,-15.87; CN12_50 31.75,-15.87; CN12_51 29.21,-18.41; CN12_52 31.75,-18.41; CN12_53 29.21,-20.95; CN12_54 31.75,-20.95; CN12_55 29.21,-23.49; CN12_56 31.75,-23.49; CN12_57 29.21,-26.03; CN12_58 31.75,-26.03; CN12_59 29.21,-28.57; CN12_60 31.75,-28.57; CN12_61 29.21,-31.11; CN12_62 31.75,-31.11; CN12_63 29.21,-33.65; CN12_64 31.75,-33.65; CN12_65 29.21,-36.19; CN12_66 31.75,-36.19; CN12_67 29.21,-38.73; CN12_68 31.75,-38.73; CN12_69 29.21,-41.27; CN12_70 31.75,-41.27; CN12_71 29.21,-43.81; CN12_72 31.75,-43.81
PSH04-02 = drill 1.7 pad 3 octagon: P$1 0,0; P$2 3.96,0
W237-8P = drill 1.194 long: 1 -17.78,-0.635; 2 -12.7,-0.635; 3 -7.62,-0.635; 4 -2.54,-0.635; 5 2.54,-0.635; 6 7.62,-0.635; 7 12.7,-0.635; 8 17.78,-0.635

### Placement (x,y rotation side)
EXT_GND  158.75,7.62 90 top
LIGHTS  116.84,148.59 180 top
OK1  140.97,151.13 90 bottom
OK2  140.97,144.78 90 bottom
OK3  140.97,138.43 90 bottom
OK4  140.97,132.08 90 bottom
OK5  140.97,125.73 90 bottom
OK6  140.97,119.38 90 bottom
OK7  140.97,113.03 90 bottom
OK8  140.97,106.68 90 bottom
OK9  140.97,100.33 90 bottom
OK10  140.97,93.98 90 bottom
OK11  140.97,87.63 90 bottom
OK12  140.97,81.28 90 bottom
OK13  140.97,74.93 90 bottom
OK14  140.97,68.58 90 bottom
OK15  140.97,62.23 90 bottom
OK16  140.97,55.88 90 bottom
OK17  140.97,49.53 270 top
OK18  140.97,43.18 270 top
OK19  140.97,36.83 270 top
OK20  140.97,30.48 270 top
OK21  140.97,24.13 270 top
OK22  140.97,17.78 270 top
OK23  140.97,11.43 270 top
OK24  140.97,5.08 270 top
OK25  116.84,134.62 270 top
OK26  100.33,134.62 270 top
POWER_5V  19.05,148.59 180 top
POWER_GND  41.91,148.59 180 top
Q1  149.86,151.13 270 bottom
Q2  149.86,144.78 270 bottom
Q3  149.86,138.43 270 bottom
Q4  149.86,132.08 270 bottom
Q5  149.86,125.73 270 bottom
Q6  149.86,119.38 270 bottom
Q7  149.86,113.03 270 bottom
Q8  149.86,106.68 270 bottom
Q9  149.86,55.88 270 bottom
Q10  149.86,62.23 270 bottom
Q11  149.86,68.58 270 bottom
Q12  149.86,74.93 270 bottom
Q13  149.86,81.28 270 bottom
Q14  149.86,87.63 270 bottom
Q15  149.86,93.98 270 bottom
Q16  149.86,100.33 270 bottom
Q17  149.86,49.53 90 top
Q18  149.86,43.18 90 top
Q19  149.86,36.83 90 top
Q20  149.86,30.48 90 top
Q21  149.86,24.13 90 top
Q22  149.86,17.78 90 top
Q23  149.86,11.43 90 top
Q24  149.86,5.08 90 top
Q25  109.22,137.16 0 top
Q26  125.73,135.89 0 top
R1  132.08,149.86 180 bottom
R2  132.08,143.51 180 bottom
R3  132.08,137.16 180 bottom
R4  132.08,130.81 180 bottom
R5  132.08,124.46 180 bottom
R6  132.08,118.11 180 bottom
R7  132.08,111.76 180 bottom
R8  132.08,105.41 180 bottom
R9  132.08,99.06 180 bottom
R10  132.08,92.71 180 bottom
R11  132.08,86.36 180 bottom
R12  132.08,80.01 180 bottom
R13  132.08,73.66 180 bottom
R14  132.08,67.31 180 bottom
R15  132.08,60.96 180 bottom
R16  132.08,54.61 180 bottom
R17  132.08,50.8 0 top
R18  132.08,44.45 0 top
R19  132.08,38.1 0 top
R20  132.08,31.75 0 top
R21  132.08,25.4 0 top
R22  132.08,19.05 0 top
R23  132.08,12.7 0 top
R24  132.08,6.35 0 top
R25  44.45,133.35 90 top
R26  35.56,133.35 90 top
R27  43.18,125.73 90 top
R28  35.56,125.73 90 top
R29  43.18,118.11 90 top
R30  35.56,118.11 90 top
R31  43.18,110.49 90 top
R32  35.56,110.49 90 top
R33  44.45,86.36 90 top
R34  35.56,86.36 90 top
R35  43.18,78.74 90 top
R36  35.56,78.74 90 top
R37  43.18,71.12 90 top
R38  35.56,71.12 90 top
R39  43.18,63.5 90 top
R40  35.56,63.5 90 top
R41  44.45,40.64 90 top
R42  35.56,40.64 90 top
R43  44.45,33.02 90 top
R44  35.56,33.02 90 top
R45  44.45,25.4 90 top
R46  35.56,25.4 90 top
R47  44.45,17.78 90 top
R48  35.56,17.78 90 top
R49  115.57,129.54 0 top
R50  100.33,129.54 180 top
RELE_EN  104.14,148.59 180 top
U1  86.36,63.5 0 top
U$1  26.67,138.43 180 top
U$2  10.16,138.43 180 top
U$3  26.67,127 180 top
U$4  10.16,127 180 top
U$5  26.67,115.57 180 top
U$6  10.16,115.57 180 top
U$7  26.67,104.14 180 top
U$8  10.16,104.14 180 top
U$9  26.67,92.71 180 top
U$10  10.16,92.71 180 top
U$11  26.67,81.28 180 top
U$12  10.16,81.28 180 top
U$13  26.67,69.85 180 top
U$14  10.16,69.85 180 top
U$15  26.67,58.42 180 top
U$16  10.16,58.42 180 top
U$17  26.67,46.99 180 top
U$18  10.16,46.99 180 top
U$19  26.67,35.56 180 top
U$20  10.16,35.56 180 top
U$21  26.67,24.13 180 top
U$22  10.16,24.13 180 top
U$23  26.67,12.7 180 top
U$24  10.16,12.7 180 top
X1  158.75,82.55 90 top
X2  158.75,38.1 90 top
X4  158.75,127 90 top

### Tracks (layer width: path | path; a pad name or v marks a point on that pad's centre or on a via)
GND  (via drill 0.8, 0.8 pad 1.2)
  Top 0.61: 113.03,99.06 113.66,98.43 U1.CN12_9 | OK18.2 139.7,41.91
  Top 0.813: POWER_GND.4 POWER_GND.3 POWER_GND.2 POWER_GND.1 | OK26.2 v92.71,133.35 81.28,144.78 v81.28,152.4 | v109.22,133.35 OK25.2 | U$15.P$2 22.71,56.03 25.4,53.34 29.21,53.34 33.02,57.15 45.72,57.15 46.99,55.88 46.99,53.34 52.7,47.63 U1.CN11_49 | 139.7,35.56 139.7,41.91 v139.7,43.18 v139.7,48.26 OK17.2 | 139.7,35.56 139.7,29.21 | 139.7,29.21 139.7,22.86 | 139.7,22.86 139.7,16.51 | 139.7,16.51 139.7,10.16 | 139.7,10.16 139.7,3.81 OK24.2 | OK23.2 139.7,10.16 | OK22.2 139.7,16.51 | OK21.2 139.7,22.86 | OK20.2 139.7,29.21 | OK19.2 139.7,35.56 | U1.CN12_72 U1.CN12_71 113.66,19.69 113.03,20.32 113.03,29.21 | 113.03,29.21 113.03,59.69 | 113.03,59.69 v113.03,86.36 113.03,99.06 v113.03,104.14 | 113.03,29.21 114.93,29.21 U1.CN12_63 | 113.03,59.69 114.93,59.69 U1.CN12_39
  Bottom 0.305: v113.03,86.36 113.23,86.36 113.8,86.94 116.91,86.94 U1.CN12_20
  Bottom 0.61: OK1.2 v81.28,152.4
  Bottom 0.813: U$23.P$2 U$21.P$2 U$19.P$2 U$17.P$2 U$15.P$2 U$13.P$2 U$11.P$2 U$9.P$2 U$7.P$2 U$5.P$2 U$3.P$2 22.86,127 22.71,127.15 U$1.P$2 22.71,139.85 20.32,142.24 8.89,142.24 | U$24.P$2 U$22.P$2 U$20.P$2 U$18.P$2 U$16.P$2 U$14.P$2 U$12.P$2 U$10.P$2 U$8.P$2 U$6.P$2 U$4.P$2 U$2.P$2 6.2,139.55 8.89,142.24 | v92.71,133.35 v109.22,133.35 110.49,133.35 113.03,130.81 v113.03,104.14 | POWER_GND.1 52.7,152.4 59.69,152.4 | v81.28,152.4 59.69,152.4 | 8.89,142.24 7.62,143.51 7.62,151.13 10.16,153.67 29.84,153.67 POWER_GND.4 | v132.08,57.15 OK16.2 139.7,57.15 | OK1.2 139.7,152.4 139.7,146.05 | 139.7,146.05 139.7,139.7 | 139.7,139.7 139.7,133.35 | 139.7,133.35 139.7,127 | 139.7,127 139.7,120.65 | 139.7,120.65 139.7,114.3 | 139.7,114.3 139.7,107.95 | 139.7,107.95 139.7,101.6 | 139.7,101.6 139.7,95.25 | 139.7,95.25 139.7,88.9 | 139.7,88.9 139.7,82.55 | 139.7,82.55 139.7,76.2 | 139.7,76.2 139.7,69.85 | 139.7,69.85 139.7,63.5 | 139.7,63.5 139.7,57.15 | 139.7,57.15 v139.7,48.26 | OK15.2 139.7,63.5 | OK14.2 139.7,69.85 | OK13.2 139.7,76.2 | OK12.2 139.7,82.55 | OK11.2 139.7,88.9 | OK10.2 139.7,95.25 | OK9.2 139.7,101.6 | OK8.2 139.7,107.95 | OK7.2 139.7,114.3 | OK6.2 139.7,120.65 | OK5.2 139.7,127 | OK4.2 139.7,133.35 | OK3.2 139.7,139.7 | OK2.2 139.7,146.05 | U1.CN11_19 U1.CN11_20 U1.CN11_22 59.06,83.19 | 59.06,83.19 59.69,83.82 59.69,101.6 | U1.CN11_60 59.06,34.93 | 59.06,34.93 59.69,35.56 59.69,82.56 59.06,83.19 | U1.CN11_8 59.06,100.97 59.69,101.6 | 59.69,101.6 59.69,152.4 | U1.CN11_71 U1.CN11_72 59.06,19.69 59.69,20.32 59.69,34.3 59.06,34.93 | U1.CN12_54 139.07,42.55 v139.7,43.18
  pour Top (isolate 1): 0,156.21 167.64,156.21 167.64,0 0,0
  pour Bottom (isolate 1): 0,156.21 0,0 167.64,0 167.64,156.21
GND1  (via drill 0.8)
  Top 0.813: EXT_GND.2 159.38,6.35 | 159.38,6.35 EXT_GND.1 | Q24.E v153.67,6.03 159.06,6.03 159.38,6.35 | v142.24,6.35 v142.24,11.43 v142.24,17.78 v142.24,24.13 v142.24,30.48 v142.24,36.83 v142.24,43.18 v142.24,50.8 142.24,54.61 | 142.24,54.61 142.24,60.96 | 142.24,60.96 142.24,67.31 | 142.24,67.31 142.24,73.66 | 142.24,73.66 142.24,80.01 | 142.24,80.01 142.24,86.36 | 142.24,86.36 142.24,92.71 | 142.24,92.71 142.24,99.06 | 142.24,99.06 142.24,105.41 | 142.24,105.41 142.24,111.76 | 142.24,111.76 142.24,118.11 | 142.24,118.11 142.24,124.46 | 142.24,124.46 142.24,130.81 | 142.24,130.81 142.24,137.16 | 142.24,137.16 142.24,143.51 | 142.24,143.51 142.24,149.86 v153.67,149.86 | v153.67,143.51 142.24,143.51 | v153.67,137.16 142.24,137.16 | v153.67,130.81 142.24,130.81 | v153.67,124.46 142.24,124.46 | v153.67,118.11 142.24,118.11 | v153.67,111.76 142.24,111.76 | v153.67,105.41 142.24,105.41 | v153.67,99.06 142.24,99.06 | v153.67,92.71 142.24,92.71 | v153.67,86.36 142.24,86.36 | v153.67,80.01 142.24,80.01 | v153.48,73.85 142.43,73.85 142.24,73.66 | v153.48,67.5 153.48,67.31 142.24,67.31 | v153.67,60.96 142.24,60.96 | v153.67,54.61 142.24,54.61 | Q17.E 153.35,50.48 v153.67,50.8 | Q18.E 152.72,44.13 v153.67,43.18 | Q19.E 152.72,37.78 v153.67,36.83 | Q20.E 151.45,31.43 v152.4,30.48 | Q21.E 152.72,25.08 v153.48,24.32 | Q22.E 152.72,18.73 v153.67,17.78 | Q23.E 152.72,12.38 v153.67,11.43 | 142.24,130.81 125.73,130.81 | Q26.E 126.68,131.76 125.73,130.81 | Q25.E 110.17,136.84 111.76,138.43 115.57,138.43 118.11,135.89 118.11,133.35 120.65,130.81 125.73,130.81
  Bottom 0.813: v153.67,6.03 142.56,6.03 v142.24,6.35 | v153.67,149.86 153.35,150.18 Q1.E | Q2.E 153.35,143.83 v153.67,143.51 | Q3.E 153.35,137.48 v153.67,137.16 | Q4.E 151.28,130.81 v153.67,130.81 | Q5.E 151.28,124.46 v153.67,124.46 | Q6.E 151.28,118.11 v153.67,118.11 | Q7.E 151.28,111.76 v153.67,111.76 | Q8.E 151.28,105.41 v153.67,105.41 | Q16.E 151.28,99.06 v153.67,99.06 | Q15.E 151.28,92.71 v153.67,92.71 | Q14.E 151.28,86.36 v153.67,86.36 | Q13.E 151.28,80.01 v153.67,80.01 | Q12.E 151.09,73.85 v153.48,73.85 | Q11.E 153.35,67.63 v153.48,67.5 | Q10.E 151.28,60.96 v153.67,60.96 | Q9.E 151.28,54.61 v153.67,54.61 | v153.67,50.8 v142.24,50.8 | v153.67,43.18 v142.24,43.18 | v153.67,36.83 v142.24,36.83 | v152.4,30.48 v142.24,30.48 | v153.48,24.32 153.3,24.13 v142.24,24.13 | v153.67,17.78 v142.24,17.78 | v153.67,11.43 v142.24,11.43
IN_A0  (via drill 0.8 pad 1.2)
  Top 0.813: v38.1,132.08 44.32,132.08 R25.1 49.66,131.95 54.61,127 U1.CN11_1
  Bottom 0.813: v38.1,132.08 33.02,132.08 U$1.P$1
IN_A1
  Top 0.813: U$2.P$1 16.64,131.95 R26.1 37.97,129.54 45.72,129.54 52.07,123.19 52.07,108.54 53.48,107.13 53.53,107.13 U1.CN11_3
IN_A2  (via drill 0.8, 0.8 pad 1.2)
  Top 0.813: v38.1,124.46 38.23,124.33 R27.1 47.12,124.33 v48.26,123.19
  Bottom 0.813: v38.1,124.46 29.21,124.46 U$3.P$1 | v48.26,123.19 48.26,104.78 U1.CN11_9
IN_A3
  Top 0.813: U$4.P$1 12.83,124.33 R28.1 37.97,121.92 45.72,121.92 50.8,116.84 50.8,106.68 52.07,105.41 52.07,97.79 53.97,95.89 U1.CN11_11
IN_A4  (via drill 0.8 pad 1.2)
  Top 0.813: v38.1,116.84 38.23,116.71 R29.1 43.18,116.84 45.72,116.84 49.53,113.03 49.53,104.14 50.8,102.87 50.8,96.52 53.97,93.35 U1.CN11_13
  Bottom 0.813: v38.1,116.84 27.94,116.84 U$5.P$1
IN_A5
  Top 0.813: U$6.P$1 12.7,118.11 31.75,118.11 33.15,116.71 R30.1 37.97,114.3 45.72,114.3 48.26,111.76 48.26,101.6 49.53,100.33 49.53,93.98 52.7,90.81 U1.CN11_15
IN_A6  (via drill 0.8 pad 1.2)
  Top 0.813: R31.1 43.18,102.87 | 43.18,102.87 v38.1,102.87 | U1.CN11_17 52.7,88.27 48.26,92.71 48.26,97.79 43.18,102.87
  Bottom 0.813: v38.1,102.87 27.94,102.87 U$7.P$1
IN_A7
  Top 0.813: U$8.P$1 15.11,109.09 R32.1 35.56,101.6 39.37,97.79 43.18,97.79 46.99,93.98 46.99,91.44 52.07,86.36 52.07,83.19 U1.CN11_23
IN_B0  (via drill 0.8)
  Top 0.254: U1.CN11_32 55.79,71.85 53.25,71.85 52.07,73.03
  Top 0.813: U$9.P$1 v41.91,92.71 | v41.91,85.09 42.04,84.96 R33.1 49.4,84.96 49.53,85.09 50.8,83.82 50.8,82.55 52.07,81.28 52.07,73.03
  Bottom 0.813: v41.91,85.09 v41.91,92.71
IN_B1
  Top 0.813: U$10.P$1 17.78,85.09 35.43,85.09 R34.1 38.23,84.96 40.64,82.55 48.26,82.55 50.8,80.01 50.8,71.12 52.07,69.85 52.07,66.04 52.7,65.41 U1.CN11_35
IN_B2  (via drill 0.8 pad 1.2)
  Top 0.813: v38.1,77.47 43.05,77.47 R35.1 48.39,77.34 49.53,76.2 49.53,69.85 50.8,68.58 50.8,64.77 52.07,63.5 53.98,63.5 U1.CN11_37
  Bottom 0.813: v38.1,77.47 30.48,77.47 U$11.P$1
IN_B3
  Top 0.813: U$12.P$1 14.1,77.34 R36.1 35.69,77.34 38.1,74.93 46.99,74.93 48.26,73.66 48.26,68.58 49.53,67.31 49.53,63.5 52.7,60.33 U1.CN11_39
IN_B4  (via drill 0.8 pad 1.2)
  Top 0.813: v38.1,69.85 38.23,69.72 R37.1 44.45,69.72 48.13,66.04 48.26,66.04 48.26,62.23 52.7,57.79 U1.CN11_41
  Bottom 0.813: v38.1,69.85 U$13.P$1
IN_B5  (via drill 0.8)
  Top 0.813: U$14.P$1 12.7,72.39 29.21,72.39 31.88,69.72 R38.1 37.97,67.31 v44.45,67.31
  Bottom 0.813: v44.45,67.31 46.99,67.31 52.07,62.23 52.07,57.15 53.97,55.25 U1.CN11_43
IN_B6  (via drill 0.8 pad 1.2)
  Top 0.813: v38.1,62.23 38.23,62.1 R39.1 45.85,62.1 52.07,55.88 52.07,53.34 52.7,52.71 U1.CN11_45
  Bottom 0.813: v38.1,62.23 30.48,62.23 U$15.P$1
IN_B7
  Top 0.813: U$16.P$1 13.84,62.1 R40.1 37.97,59.69 46.35,59.69 50.8,55.24 50.8,52.07 52.7,50.17 U1.CN11_47
IN_C0  (via drill 0.8 pad 1.2)
  Top 0.813: v44.45,36.83 R41.1 44.58,39.37 49.53,39.37 52.07,41.91 52.07,44.45 52.71,45.09 U1.CN11_51
  Bottom 0.813: v44.45,36.83 33.02,36.83 26.67,43.18 U$17.P$1
IN_C1  (via drill 0.8)
  Top 0.813: U$18.P$1 10.16,43.18 13.97,39.37 35.43,39.37 R42.1 36.83,39.24 38.1,40.51 38.1,43.18 39.37,44.45 46.99,44.45 v48.26,43.18
  Bottom 0.813: v48.26,43.18 48.89,42.55 U1.CN11_53
IN_C2  (via drill 0.8 pad 1.2)
  Top 0.813: v44.45,29.21 R43.1 44.58,31.75 49.53,31.75 50.8,33.02 50.8,35.56 52.07,36.83 52.07,39.37 52.71,40.01 U1.CN11_55
  Bottom 0.813: v44.45,29.21 29.21,29.21 26.67,31.75 U$19.P$1
IN_C3  (via drill 0.8)
  Top 0.813: v39.37,39.37 39.37,34.29 36.83,31.75 35.69,31.75 R44.1 35.43,31.75 11.43,31.75 10.16,33.02 U$20.P$1
  Bottom 0.813: U1.CN11_57 47.62,37.47 45.72,39.37 v39.37,39.37
IN_C4  (via drill 0.8 pad 1.2)
  Top 0.813: v44.45,21.59 R45.1 46.86,24 49.53,26.67 49.53,27.94 52.07,30.48 52.07,33.02 53.98,34.93 U1.CN11_59
  Bottom 0.813: v44.45,21.59 27.94,21.59 26.67,22.86 U$21.P$1
IN_C5  (via drill 0.8)
  Top 0.813: U$22.P$1 12.7,26.67 29.21,26.67 31.75,24.13 35.43,24.13 R46.1 36.7,24 40.64,27.94 40.64,31.75 v39.37,31.75
  Bottom 0.813: U1.CN11_61 40.01,32.39 v39.37,31.75
IN_C6  (via drill 0.8 pad 1.2)
  Top 0.813: v39.37,16.51 39.5,16.38 R47.1 44.58,16.51 49.53,16.51 50.8,17.78 50.8,26.67 53.98,29.85 U1.CN11_63
  Bottom 0.813: v39.37,16.51 30.48,16.51 U$23.P$1
IN_C7
  Top 0.813: U$24.P$1 15.24,17.78 29.21,17.78 30.61,16.38 R48.1 37.97,13.97 49.53,13.97 52.07,16.51 52.07,25.4 53.98,27.31 U1.CN11_65
LIGHTS
  Top 0.813: U1.CN12_1 115.57,125.73 114.17,127.13 R49.1
N$1
  Bottom 0.813: R1.2 OK1.1
N$2
  Bottom 0.813: R9.2 OK9.1
N$3
  Bottom 0.813: OK2.1 R2.2
N$4
  Bottom 0.813: OK10.1 R10.2
N$5
  Bottom 0.813: OK11.1 R11.2
N$6
  Bottom 0.813: R12.2 OK12.1
N$7
  Bottom 0.813: OK3.1 R3.2
N$8
  Bottom 0.813: OK13.1 R13.2
N$9
  Bottom 0.813: OK14.1 R14.2
N$10
  Bottom 0.813: OK4.1 R4.2
N$11
  Bottom 0.813: OK15.1 R15.2
N$12
  Bottom 0.813: OK16.1 R16.2
N$13
  Bottom 0.813: R5.2 OK5.1
N$14
  Top 0.813: R17.2 OK17.1
N$15
  Top 0.813: OK18.1 R18.2
N$16
  Bottom 0.813: OK6.1 R6.2
N$17
  Top 0.813: R19.2 OK19.1
N$18
  Top 0.813: OK20.1 R20.2
N$19
  Bottom 0.813: R7.2 OK7.1
N$20
  Top 0.813: R21.2 OK21.1
N$21
  Top 0.813: R22.2 OK22.1
N$22
  Bottom 0.813: OK8.1 R8.2
N$23
  Top 0.813: R23.2 OK23.1
N$24
  Top 0.813: R24.2 OK24.1
N$25
  Top 0.813: OK25.1 115.57,135.89 116.97,134.49 R49.2
N$26
  Top 0.813: R50.2 98.93,134.75 97.79,135.89 OK26.1
N$27
  Top 0.813: Q25.C 107.47,138.26 OK26.4 105.1,148.91 105.41,149.22
  Top 1.016: RELE_EN.2 105.41,149.22 RELE_EN.1
N$28
  Top 0.813: OK25.4 121.61,137.16 | 121.61,137.16 121.61,147 LIGHTS.1 | Q26.C 125.56,137.16 121.61,137.16
  Bottom 0.813: LIGHTS.2 LIGHTS.1
N$29
  Bottom 0.813: Q2.B 150.64,146.05 OK2.3
N$30
  Bottom 0.813: Q1.B 150.64,152.4 OK1.3
N$31
  Bottom 0.813: Q3.B 150.64,139.7 OK3.3
N$32
  Bottom 0.813: Q4.B 150.64,133.35 OK4.3
N$33
  Bottom 0.813: OK16.4 147.32,54.61 | 147.32,54.61 147.49,54.61 Q9.C | X1.1 159.38,60.33 156.21,57.15 156.21,54.61 154.94,53.34 148.59,53.34 147.32,54.61
N$34
  Bottom 0.813: Q10.C 147.49,60.96 | 147.49,60.96 OK15.4 | X1.2 156.21,66.67 156.21,60.96 154.94,59.69 148.59,59.69 148.59,59.86 147.49,60.96
N$35
  Bottom 0.813: Q11.C 147.49,67.31 | 147.49,67.31 OK14.4 | X1.3 156.21,71.75 156.21,68.58 153.67,66.04 148.59,66.04 147.49,67.14 147.49,67.31
N$36
  Bottom 0.813: Q12.C 147.49,73.66 147.32,73.66 | 147.32,73.66 OK13.4 | X1.4 156.21,76.83 156.21,73.66 154.94,72.39 148.59,72.39 147.32,73.66
N$37
  Bottom 0.813: Q13.C 147.49,80.01 147.32,80.01 | 147.32,80.01 OK12.4 | X1.5 159.38,83.82 154.31,78.74 148.59,78.74 147.32,80.01
N$38
  Bottom 0.813: Q14.C 147.49,86.36 147.32,86.36 | 147.32,86.36 OK11.4 | X1.6 154.31,85.09 148.59,85.09 147.32,86.36
N$39
  Bottom 0.813: Q15.C 147.49,92.71 147.32,92.71 | 147.32,92.71 OK10.4 | X1.7 155.57,91.44 148.59,91.44 147.32,92.71
N$40
  Bottom 0.813: OK9.4 147.32,99.06 | 147.32,99.06 147.49,99.06 Q16.C | X1.8 156.84,97.79 148.59,97.79 147.32,99.06
N$41
  Top 0.813: OK17.4 147.49,50.8 | 147.49,50.8 Q17.C | 147.49,50.8 148.76,52.07 155.57,52.07 X2.8
N$42
  Top 0.813: OK18.4 147.49,44.45 | 147.49,44.45 Q18.C | 147.49,44.45 148.76,45.72 153.67,45.72 158.75,50.8 X2.7
N$43
  Top 0.813: OK19.4 147.49,38.1 | 147.49,38.1 Q19.C | 147.49,38.1 148.76,39.37 153.03,39.37 X2.6
N$44
  Top 0.813: OK20.4 147.49,31.75 | 147.49,31.75 Q20.C | 147.49,31.75 148.76,33.02 152.4,33.02 159.38,40.01 X2.5
N$45
  Top 0.813: OK21.4 147.49,25.4 | 147.49,25.4 Q21.C | 147.49,25.4 148.76,26.67 151.13,26.67 159.38,34.92 X2.4
N$46
  Top 0.813: OK22.4 147.49,19.05 | 147.49,19.05 Q22.C | 147.49,19.05 148.76,20.32 152.4,20.32 155.57,23.5 155.57,26.67 X2.3
N$47
  Top 0.813: OK23.4 147.49,12.7 | 147.49,12.7 Q23.C | 147.49,12.7 148.76,13.97 152.4,13.97 155.57,17.14 155.57,21.59 X2.2
N$48
  Top 0.813: OK24.4 147.49,6.35 | 147.49,6.35 Q24.C | 147.49,6.35 148.76,7.62 153.67,7.62 156.21,10.16 156.21,13.97 159.38,17.14 X2.1
N$49
  Bottom 0.813: Q5.B 150.64,127 OK5.3
N$50
  Bottom 0.813: Q6.B 150.64,120.65 OK6.3
N$51
  Bottom 0.813: Q7.B 150.64,114.3 OK7.3
N$52
  Bottom 0.813: Q8.B 150.64,107.95 OK8.3
N$53
  Bottom 0.813: Q9.B 150.64,57.15 OK16.3
N$54
  Bottom 0.813: Q10.B 150.64,63.5 OK15.3
N$55
  Bottom 0.813: Q12.B 150.64,76.2 OK13.3
N$56
  Bottom 0.813: Q11.B 150.64,69.85 OK14.3
N$57
  Bottom 0.813: Q13.B 150.64,82.55 OK12.3
N$58
  Bottom 0.813: Q14.B 150.64,88.9 OK11.3
N$59
  Bottom 0.813: Q15.B 150.64,95.25 OK10.3
N$60
  Bottom 0.813: Q16.B 150.64,101.6 OK9.3
N$61
  Top 0.813: OK17.3 150.64,48.26 Q17.B
N$62
  Top 0.813: OK18.3 150.64,41.91 Q18.B
N$63
  Top 0.813: OK19.3 150.64,35.56 Q19.B
N$64
  Top 0.813: OK20.3 150.64,29.21 Q20.B
N$65
  Top 0.813: OK21.3 150.64,22.86 Q21.B
N$66
  Top 0.813: OK22.3 150.64,16.51 Q22.B
N$67
  Top 0.813: OK23.3 150.64,10.16 Q23.B
N$68
  Top 0.813: OK24.3 150.64,3.81 Q24.B
N$69
  Top 0.813: OK26.3 106.68,133.35 108.27,134.94 Q25.B
N$70
  Top 0.813: Q26.B 123.34,133.35 OK25.3
RELE_EN
  Top 0.813: U1.CN12_3 113.66,106.05 113.03,106.68 113.03,124.46 107.95,129.54 R50.1
VCC  (via drill 0.8 pad 1.2)
  Top 0.813: R33.2 v40.64,87.76 R34.2 | R36.2 v40.64,80.14 R35.2 | R38.2 v40.64,72.52 R37.2 | R40.2 v40.64,64.9 R39.2 | R42.2 35.43,41.91 v33.02,41.91 | R41.2 44.32,41.91 v41.91,41.91 v41.91,34.29 | R44.2 33.15,34.42 v33.02,34.29 | v41.91,34.29 44.32,34.29 R43.2 | R46.2 33.15,26.8 v33.02,26.67 | v41.91,26.67 42.04,26.8 R45.2 | R48.2 41.91,19.18 | 41.91,19.18 R47.2 | v41.91,26.67 41.91,19.18 | v41.91,26.67 v41.91,34.29 | R26.2 v40.64,134.75 R25.2 44.58,134.62 58.42,134.62 59.69,133.35 59.69,88.9 59.06,88.27 U1.CN11_18 | R28.2 v40.64,127.13 R27.2 | R30.2 v40.64,119.51 R29.2 | R32.2 v40.64,111.89 R31.2 | POWER_5V.1 POWER_5V.2 POWER_5V.3 POWER_5V.4
  Bottom 0.813: v33.02,41.91 40.64,41.91 | 40.64,41.91 v41.91,41.91 | v33.02,34.29 v41.91,34.29 | v33.02,26.67 v41.91,26.67 | 40.64,41.91 v40.64,64.9 v40.64,72.52 v40.64,80.14 v40.64,87.76 v40.64,111.89 v40.64,119.51 v40.64,127.13 v40.64,134.75 40.64,139.7 36.2,139.7 POWER_5V.1
XA0
  Bottom 0.813: R1.1 123.19,149.86 121.92,148.59 121.92,142.24 118.11,138.43 U1.CN12_2
XA1
  Bottom 0.813: U1.CN12_4 120.65,108.59 120.65,110.49 119.38,111.76 119.38,137.16 121.92,139.7 127,139.7 130.68,143.38 R2.1
XA2  (via drill 0.8)
  Top 0.813: U1.CN12_16 121.92,94.62 v121.92,125.73
  Bottom 0.813: R3.1 123.19,137.16 121.92,135.89 v121.92,125.73
XA3
  Bottom 0.813: R4.1 121.92,122.05 121.92,106.68 120.65,105.41 120.65,90.17 118.75,88.27 U1.CN12_18
XA4
  Bottom 0.813: R5.1 123.19,116.97 123.19,105.41 121.92,104.14 121.92,83.82 121.29,83.19 U1.CN12_22
XA5
  Bottom 0.813: R6.1 124.46,111.89 124.46,104.14 123.19,102.87 123.19,82.55 121.29,80.65 U1.CN12_24
XA6
  Bottom 0.813: R7.1 125.73,106.81 125.73,102.87 124.46,101.6 124.46,81.28 121.29,78.11 U1.CN12_26
XA7
  Bottom 0.813: R8.1 125.73,100.46 125.73,72.39 118.75,65.41 U1.CN12_36
XB0  (via drill 0.8)
  Top 0.813: v128.27,99.06 121.92,92.71 121.92,66.04 118.75,62.87 U1.CN12_38
  Bottom 0.813: R9.1 v128.27,99.06
XB1  (via drill 0.8)
  Top 0.813: v128.27,92.71 125.73,92.71 124.46,91.44 124.46,66.04 118.75,60.33 U1.CN12_40
  Bottom 0.813: R10.1 v128.27,92.71
XB2  (via drill 0.8)
  Top 0.813: v128.27,86.36 127,85.09 127,64.77 120.02,57.79 U1.CN12_42
  Bottom 0.813: R11.1 v128.27,86.36
XB3
  Bottom 0.813: R12.1 130.68,77.34 128.27,74.93 128.27,71.12 124.46,67.31 124.46,58.42 121.29,55.25 U1.CN12_44
XB4
  Bottom 0.813: R13.1 130.68,70.99 125.73,66.04 125.73,57.15 121.29,52.71 U1.CN12_46
XB5
  Bottom 0.813: R14.1 127,63.63 127,55.88 121.29,50.17 U1.CN12_48
XB6
  Bottom 0.813: U1.CN12_50 121.29,47.63 128.27,54.61 128.27,58.55 R15.1
XB7
  Bottom 0.813: R16.1 121.16,45.09 U1.CN12_52
XC0
  Top 0.813: U1.CN12_56 120.02,40.01 130.68,50.67 R17.1
XC1
  Top 0.813: U1.CN12_58 123.83,37.47 130.81,44.45 R18.1
XC2
  Top 0.813: U1.CN12_60 127.51,34.93 R19.1
XC3
  Top 0.813: R20.1 130.04,32.39 U1.CN12_62
XC4
  Top 0.813: R21.1 123.19,25.4 118.74,29.85 U1.CN12_64
XC5
  Top 0.813: R22.1 130.68,20.32 125.73,20.32 118.74,27.31 U1.CN12_66
XC6
  Top 0.813: R23.1 118.61,24.77 U1.CN12_68
XC7
  Top 0.813: R24.1 120.65,16.38 120.65,20.32 118.74,22.23 U1.CN12_70
YA0
  Bottom 0.813: OK1.4 147.49,149.86 | 147.49,149.86 Q1.C | X4.8 155.57,148.59 148.76,148.59 147.49,149.86
YA1
  Bottom 0.813: OK2.4 147.49,143.51 | 147.49,143.51 Q2.C | X4.7 156.84,142.24 148.76,142.24 147.49,143.51
YA2
  Bottom 0.813: OK3.4 147.49,137.16 | 147.49,137.16 Q3.C | X4.6 158.12,135.89 148.59,135.89 147.49,136.99 147.49,137.16
YA3
  Bottom 0.813: OK4.4 147.49,130.81 | 147.49,130.81 Q4.C | X4.5 148.59,129.54 147.49,130.64 147.49,130.81
YA4
  Bottom 0.813: OK5.4 147.49,124.46 | 147.49,124.46 Q5.C | X4.4 158.12,123.19 148.59,123.19 148.59,123.36 147.49,124.46
YA5
  Bottom 0.813: OK6.4 147.32,118.11 | 147.32,118.11 147.49,118.11 Q6.C | X4.3 156.84,116.84 148.59,116.84 147.32,118.11
YA6
  Bottom 0.813: OK7.4 147.49,111.76 | 147.49,111.76 Q7.C | X4.2 155.57,110.49 148.59,110.49 148.59,110.66 147.49,111.76
YA7
  Bottom 0.813: OK8.4 147.32,105.41 | 147.32,105.41 147.49,105.41 Q8.C | X4.1 159.38,107.95 155.57,104.14 148.59,104.14 147.32,105.41

### Text on the board
tNames: GND | 5V | 0 | RELE EN | LIGHTS | 1 | IN_1 | IN_0 | 2 | 3 | IN_3 | IN_2 | 4 | 5 | 6 | IN_5 | IN_4 | 7 | IN_7 | IN_6 | 8 | 9 | 10 | IN_9 | IN_8 | 11 | 12 | IN_11 | IN_10 | BringAuto MCU | 13 | 14 | IN_13 | IN_12 | 15 | 16 | IN_15 | IN_14 | 17 | 18 | IN_17 | IN_16 | 19 | 20 | IN_19 | IN_18 | 21 | 22 | IN_21 | IN_20 | 23 | IN_23 | IN_22 | RELE GND